# Altium project STEERING_WHEEL_SWITCHES_V2_CONTROLLER.PrjPcb
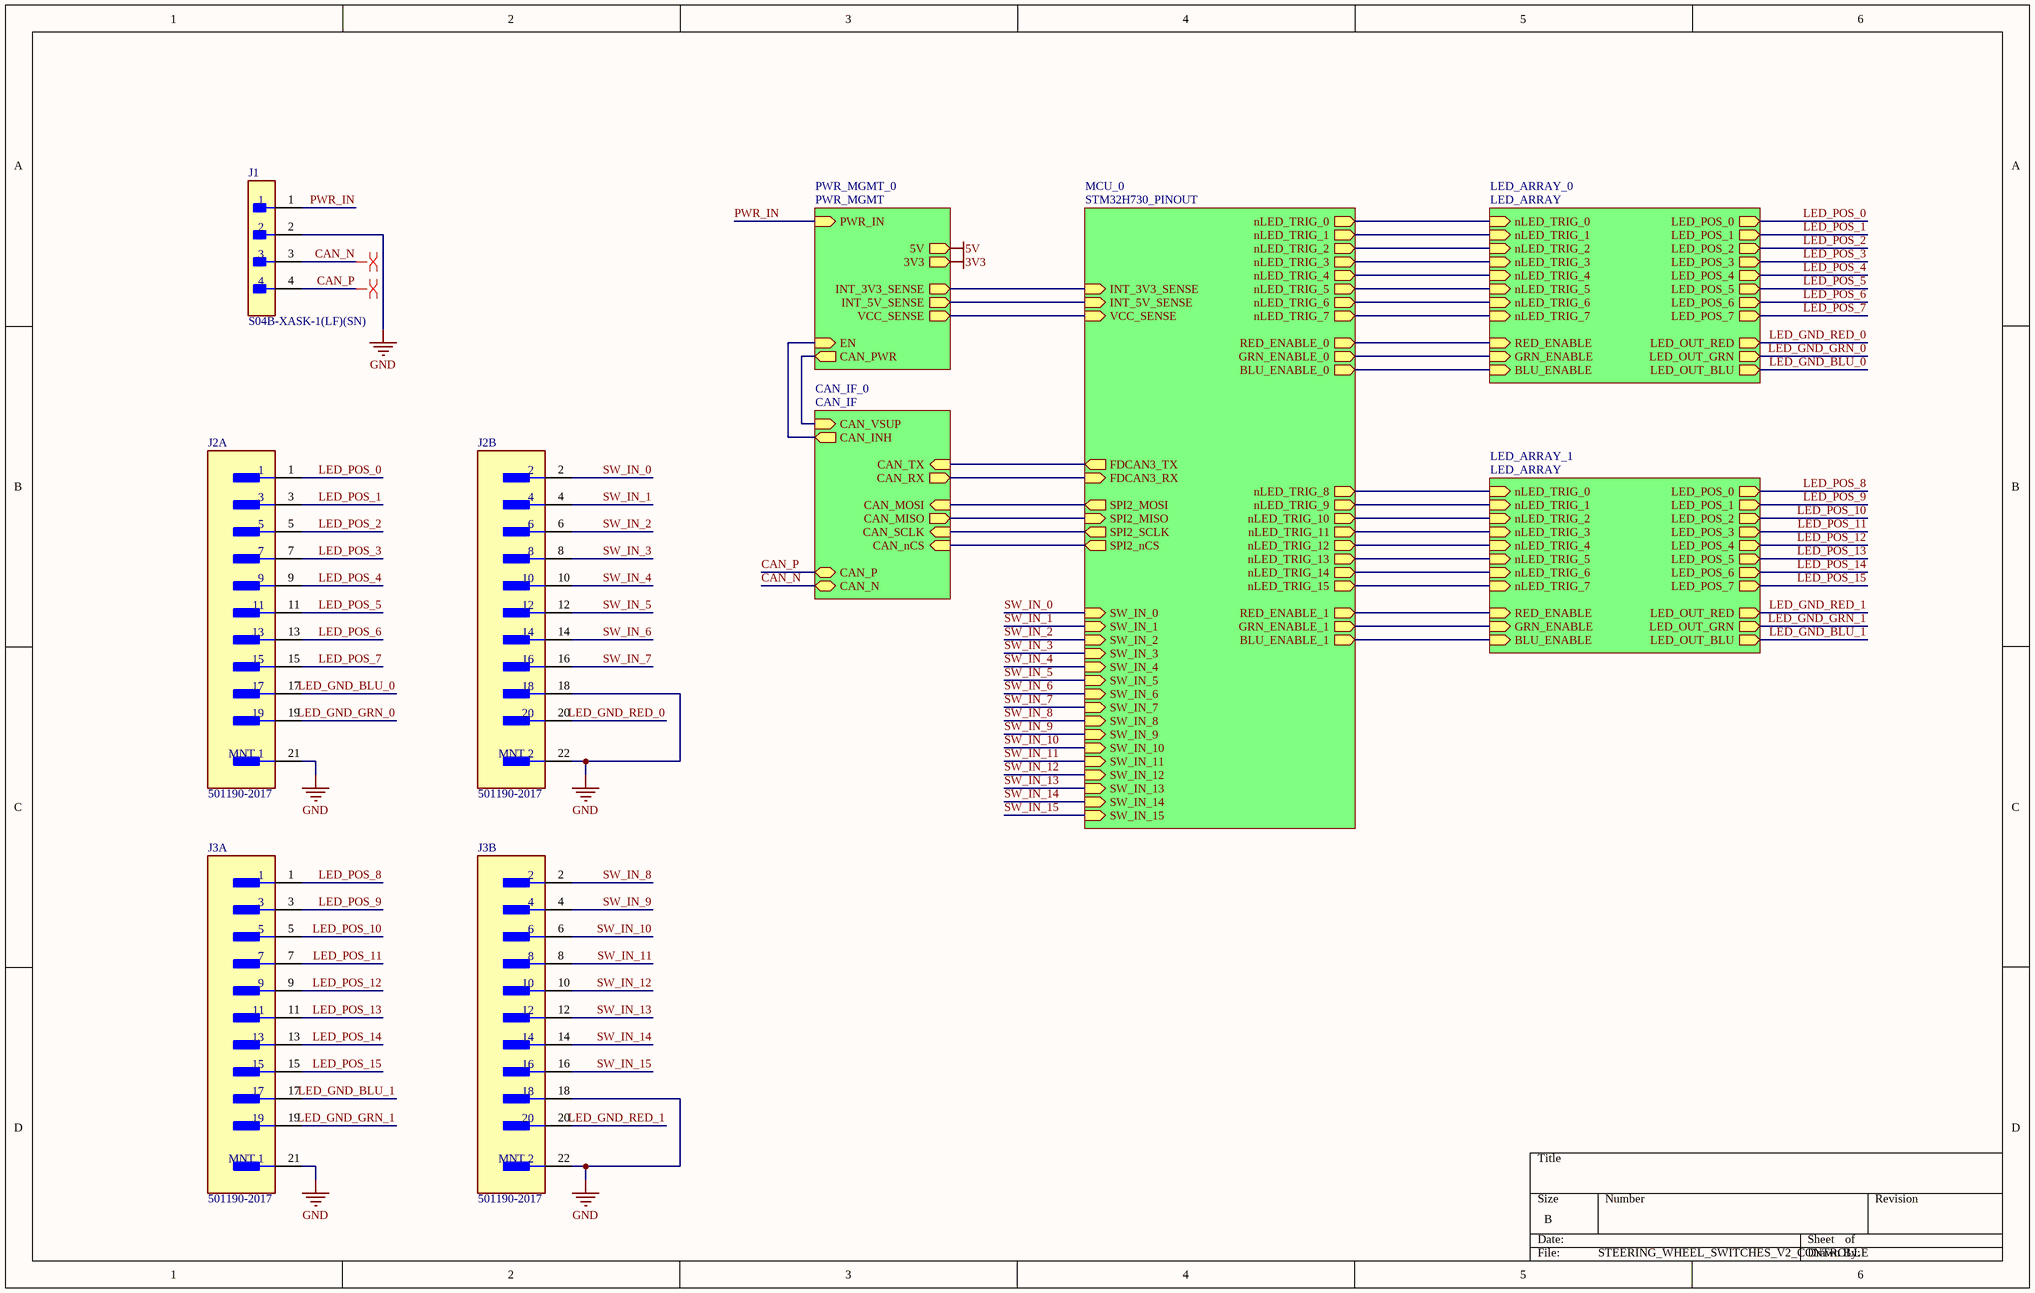
[diagram p0: STEERING_WHEEL_SWITCHES_V2_CONTROLLER.SchDoc]
4 sheets, 82 parts. Net scope: hierarchical (ports join the sheet entries above them; power ports are global).
Board file: STEERING_WHEEL_SWITCHES_V2_CONTROLLER.PcbDoc
Sheets:
  STEERING_WHEEL_SWITCHES_V2_CONTROLLER.SchDoc
    MCU_0 = STM32H730_PINOUT.SchDoc
    PWR_MGMT_0 = PWR_MGMT.SchDoc
    CAN_IF_0 = CAN_IF.SchDoc

## Sheet STEERING_WHEEL_SWITCHES_V2_CONTROLLER.SchDoc
size B; SheetNumber: 1; SheetTotal: 5

### Parts
J1  S04B-XASK-1(LF)(SN)  [FP-S04B-XASK-1_LF_SN-MFG]
J2  501190-2017  [FP-501190-2017-MFG]  (parts A,B of 2)
J3  501190-2017  [FP-501190-2017-MFG]  (parts A,B of 2)

### Sub-sheets
CAN_IF_0 = CAN_IF: CAN_VSUP (in), CAN_INH (out), CAN_MOSI (in), CAN_MISO (out), CAN_SCLK (in), CAN_nCS (in), CAN_P (bidir), CAN_N (bidir), CAN_TX (in), CAN_RX (out)
LED_ARRAY_0 = LED_ARRAY (file not in this document): nLED_TRIG_0 (in), nLED_TRIG_1 (in), nLED_TRIG_2 (in), nLED_TRIG_3 (in), nLED_TRIG_4 (in), nLED_TRIG_5 (in), nLED_TRIG_6 (in), nLED_TRIG_7 (in), RED_ENABLE (in), GRN_ENABLE (in), BLU_ENABLE (in), LED_POS_0 (out), LED_POS_1 (out), LED_POS_2 (out), LED_POS_3 (out), LED_POS_4 (out), LED_POS_5 (out), LED_POS_6 (out), LED_POS_7 (out), LED_OUT_RED (out), LED_OUT_GRN (out), LED_OUT_BLU (out)
LED_ARRAY_1 = LED_ARRAY (file not in this document): nLED_TRIG_0 (in), nLED_TRIG_1 (in), nLED_TRIG_2 (in), nLED_TRIG_3 (in), nLED_TRIG_4 (in), nLED_TRIG_5 (in), nLED_TRIG_6 (in), nLED_TRIG_7 (in), RED_ENABLE (in), GRN_ENABLE (in), BLU_ENABLE (in), LED_POS_0 (out), LED_POS_1 (out), LED_POS_2 (out), LED_POS_3 (out), LED_POS_4 (out), LED_POS_5 (out), LED_POS_6 (out), LED_POS_7 (out), LED_OUT_RED (out), LED_OUT_GRN (out), LED_OUT_BLU (out)
MCU_0 = STM32H730_PINOUT: nLED_TRIG_0 (out), nLED_TRIG_1 (out), nLED_TRIG_2 (out), nLED_TRIG_3 (out), nLED_TRIG_4 (out), nLED_TRIG_5 (out), nLED_TRIG_6 (out), nLED_TRIG_7 (out), RED_ENABLE_0 (out), GRN_ENABLE_0 (out), BLU_ENABLE_0 (out), RED_ENABLE_1 (out), GRN_ENABLE_1 (out), BLU_ENABLE_1 (out), nLED_TRIG_8 (out), nLED_TRIG_9 (out), nLED_TRIG_10 (out), nLED_TRIG_11 (out), nLED_TRIG_12 (out), nLED_TRIG_13 (out), nLED_TRIG_14 (out), nLED_TRIG_15 (out), INT_3V3_SENSE (in), INT_5V_SENSE (in), VCC_SENSE (in), SW_IN_0 (in), SW_IN_1 (in), SW_IN_2 (in), SW_IN_3 (in), SW_IN_4 (in), SW_IN_5 (in), SW_IN_6 (in), SW_IN_7 (in), SW_IN_8 (in), SW_IN_9 (in), SW_IN_10 (in), SW_IN_11 (in), SW_IN_12 (in), SW_IN_13 (in), SW_IN_14 (in), SW_IN_15 (in), FDCAN3_TX (out), FDCAN3_RX (in), SPI2_MOSI (out), SPI2_MISO (in), SPI2_SCLK (out), SPI2_nCS (out)
PWR_MGMT_0 = PWR_MGMT: PWR_IN (in), 5V (out), 3V3 (out), INT_3V3_SENSE (out), INT_5V_SENSE (out), VCC_SENSE (out), CAN_PWR (out), EN (in)

### Nets
GND: J1.2 J2.18 J2.21(MNT_1) J2.22(MNT_2) J3.18 J3.21(MNT_1) J3.22(MNT_2)
BLU_ENABLE_0: sheet MCU_0/BLU_ENABLE_0, sheet LED_ARRAY_0/BLU_ENABLE
BLU_ENABLE_1: sheet MCU_0/BLU_ENABLE_1, sheet LED_ARRAY_1/BLU_ENABLE
CAN_INH: sheet PWR_MGMT_0/EN, sheet CAN_IF_0/CAN_INH
CAN_MISO: sheet MCU_0/SPI2_MISO, sheet CAN_IF_0/CAN_MISO
CAN_MOSI: sheet MCU_0/SPI2_MOSI, sheet CAN_IF_0/CAN_MOSI
CAN_N: J1.3 ; sheet CAN_IF_0/CAN_N
CAN_nCS: sheet MCU_0/SPI2_nCS, sheet CAN_IF_0/CAN_nCS
CAN_P: J1.4 ; sheet CAN_IF_0/CAN_P
CAN_PWR: sheet PWR_MGMT_0/CAN_PWR, sheet CAN_IF_0/CAN_VSUP
CAN_RX: sheet MCU_0/FDCAN3_RX, sheet CAN_IF_0/CAN_RX
CAN_SCLK: sheet MCU_0/SPI2_SCLK, sheet CAN_IF_0/CAN_SCLK
CAN_TX: sheet MCU_0/FDCAN3_TX, sheet CAN_IF_0/CAN_TX
GRN_ENABLE_0: sheet MCU_0/GRN_ENABLE_0, sheet LED_ARRAY_0/GRN_ENABLE
GRN_ENABLE_1: sheet MCU_0/GRN_ENABLE_1, sheet LED_ARRAY_1/GRN_ENABLE
INT_3V3_SENSE: sheet MCU_0/INT_3V3_SENSE, sheet PWR_MGMT_0/INT_3V3_SENSE
INT_5V_SENSE: sheet MCU_0/INT_5V_SENSE, sheet PWR_MGMT_0/INT_5V_SENSE
LED_GND_BLU_0: J2.17 ; sheet LED_ARRAY_0/LED_OUT_BLU
LED_GND_BLU_1: J3.17 ; sheet LED_ARRAY_1/LED_OUT_BLU
LED_GND_GRN_0: J2.19 ; sheet LED_ARRAY_0/LED_OUT_GRN
LED_GND_GRN_1: J3.19 ; sheet LED_ARRAY_1/LED_OUT_GRN
LED_GND_RED_0: J2.20 ; sheet LED_ARRAY_0/LED_OUT_RED
LED_GND_RED_1: J3.20 ; sheet LED_ARRAY_1/LED_OUT_RED
LED_POS_0: J2.1 ; sheet LED_ARRAY_0/LED_POS_0
LED_POS_1: J2.3 ; sheet LED_ARRAY_0/LED_POS_1
LED_POS_2: J2.5 ; sheet LED_ARRAY_0/LED_POS_2
LED_POS_3: J2.7 ; sheet LED_ARRAY_0/LED_POS_3
LED_POS_4: J2.9 ; sheet LED_ARRAY_0/LED_POS_4
LED_POS_5: J2.11 ; sheet LED_ARRAY_0/LED_POS_5
LED_POS_6: J2.13 ; sheet LED_ARRAY_0/LED_POS_6
LED_POS_7: J2.15 ; sheet LED_ARRAY_0/LED_POS_7
LED_POS_8: J3.1 ; sheet LED_ARRAY_1/LED_POS_0
LED_POS_9: J3.3 ; sheet LED_ARRAY_1/LED_POS_1
LED_POS_10: J3.5 ; sheet LED_ARRAY_1/LED_POS_2
LED_POS_11: J3.7 ; sheet LED_ARRAY_1/LED_POS_3
LED_POS_12: J3.9 ; sheet LED_ARRAY_1/LED_POS_4
LED_POS_13: J3.11 ; sheet LED_ARRAY_1/LED_POS_5
LED_POS_14: J3.13 ; sheet LED_ARRAY_1/LED_POS_6
LED_POS_15: J3.15 ; sheet LED_ARRAY_1/LED_POS_7
nLED_TRIG_0: sheet MCU_0/nLED_TRIG_0, sheet LED_ARRAY_0/nLED_TRIG_0
nLED_TRIG_1: sheet MCU_0/nLED_TRIG_1, sheet LED_ARRAY_0/nLED_TRIG_1
nLED_TRIG_2: sheet MCU_0/nLED_TRIG_2, sheet LED_ARRAY_0/nLED_TRIG_2
nLED_TRIG_3: sheet MCU_0/nLED_TRIG_3, sheet LED_ARRAY_0/nLED_TRIG_3
nLED_TRIG_4: sheet MCU_0/nLED_TRIG_4, sheet LED_ARRAY_0/nLED_TRIG_4
nLED_TRIG_5: sheet MCU_0/nLED_TRIG_5, sheet LED_ARRAY_0/nLED_TRIG_5
nLED_TRIG_6: sheet MCU_0/nLED_TRIG_6, sheet LED_ARRAY_0/nLED_TRIG_6
nLED_TRIG_7: sheet MCU_0/nLED_TRIG_7, sheet LED_ARRAY_0/nLED_TRIG_7
nLED_TRIG_8: sheet MCU_0/nLED_TRIG_8, sheet LED_ARRAY_1/nLED_TRIG_0
nLED_TRIG_9: sheet MCU_0/nLED_TRIG_9, sheet LED_ARRAY_1/nLED_TRIG_1
nLED_TRIG_10: sheet MCU_0/nLED_TRIG_10, sheet LED_ARRAY_1/nLED_TRIG_2
nLED_TRIG_11: sheet MCU_0/nLED_TRIG_11, sheet LED_ARRAY_1/nLED_TRIG_3
nLED_TRIG_12: sheet MCU_0/nLED_TRIG_12, sheet LED_ARRAY_1/nLED_TRIG_4
nLED_TRIG_13: sheet MCU_0/nLED_TRIG_13, sheet LED_ARRAY_1/nLED_TRIG_5
nLED_TRIG_14: sheet MCU_0/nLED_TRIG_14, sheet LED_ARRAY_1/nLED_TRIG_6
nLED_TRIG_15: sheet MCU_0/nLED_TRIG_15, sheet LED_ARRAY_1/nLED_TRIG_7
PWR_IN: J1.1 ; sheet PWR_MGMT_0/PWR_IN
RED_ENABLE_0: sheet MCU_0/RED_ENABLE_0, sheet LED_ARRAY_0/RED_ENABLE
RED_ENABLE_1: sheet MCU_0/RED_ENABLE_1, sheet LED_ARRAY_1/RED_ENABLE
SW_IN_0: J2.2 ; sheet MCU_0/SW_IN_0
SW_IN_1: J2.4 ; sheet MCU_0/SW_IN_1
SW_IN_2: J2.6 ; sheet MCU_0/SW_IN_2
SW_IN_3: J2.8 ; sheet MCU_0/SW_IN_3
SW_IN_4: J2.10 ; sheet MCU_0/SW_IN_4
SW_IN_5: J2.12 ; sheet MCU_0/SW_IN_5
SW_IN_6: J2.14 ; sheet MCU_0/SW_IN_6
SW_IN_7: J2.16 ; sheet MCU_0/SW_IN_7
SW_IN_8: J3.2 ; sheet MCU_0/SW_IN_8
SW_IN_9: J3.4 ; sheet MCU_0/SW_IN_9
SW_IN_10: J3.6 ; sheet MCU_0/SW_IN_10
SW_IN_11: J3.8 ; sheet MCU_0/SW_IN_11
SW_IN_12: J3.10 ; sheet MCU_0/SW_IN_12
SW_IN_13: J3.12 ; sheet MCU_0/SW_IN_13
SW_IN_14: J3.14 ; sheet MCU_0/SW_IN_14
SW_IN_15: J3.16 ; sheet MCU_0/SW_IN_15
VCC_SENSE: sheet MCU_0/VCC_SENSE, sheet PWR_MGMT_0/VCC_SENSE

### Layout directives
differential pair: CAN_N, CAN_P

### Library data of the parts
J1 = CMP-17439-000091-1: CONN HEADER R/A 4POS 2.5MM; Number of Contacts: 4; Voltage Rating (AC): 250V; Current Rating: 3A; Insulation Resistance: 1GR; Gender: Male; Wire/Cable Gauge: 20AWG; Contact Resistance: 10mR; Lead Length: 3.4mm; Insulation Material: Nylon; Fastening Type: Ramp; Height: 7.6mm; Packaging: Bulk; Voltage Rating: 250V; Contact Type: Male Pin; REACH SVHC: No SVHC; Series: XA; Connector Type: Header; Number of Positions: 4; Contact Shape: Circular; Insulation Color: Natural; Contact Finish - Mating: TIN; Number of Pins: 4; Color: Beige; Orientation: Right Angle; Length: 12.5mm; Lead Free: Lead Free; Contact Material: Copper Alloy; Min Operating Temperature: -25°C; Contact Plating: Tin; Number of Poles: 4; Number of Rows: 1; Width: 12.6mm; Voltage Rating (DC): 250V; Mount: Through Hole; Flammability Rating: UL94 V-0; Max Operating Temperature: 85°C; Termination: Solder; Material: Nylon; Pitch: 2.5mm
J2 J3 = CMP-04776-000294-1: CONN HEADER SMD 20POS 1MM; Contact Resistance: 20mR; Number of Contacts: 20; Voltage Rating: 50V; Connector Type: Male Pin; Current Rating: 1A; Glow Wire Compliant: Non-compliant; Row Spacing: 0.105inch; Gender: Male; Termination: Solder; Housing Color: Natural; Package Quantity: 1100; Contact Type: Male Pin; Number of Circuits: 20; Min Operating Temperature: -40°C; Mount: Surface Mount; Length: 12.3mm; Pitch: 1mm; Housing Material: Thermoplastic; Depth: 7.27mm; Orientation: Vertical; Max Operating Temperature: 85°C; Lead Free: Lead Free; Voltage Rating (DC): 50V; Series: Pico-Clasp; Number of Rows: 2; Contact Material: Bronze; Contact Plating: Gold; Color: Natural; Radiation Hardening: No; Fastening Type: Latch; Packaging: Tape and Reel; Number of Positions: 20

## Sheet STM32H730_PINOUT.SchDoc
size D; SheetNumber: 2; SheetTotal: 5
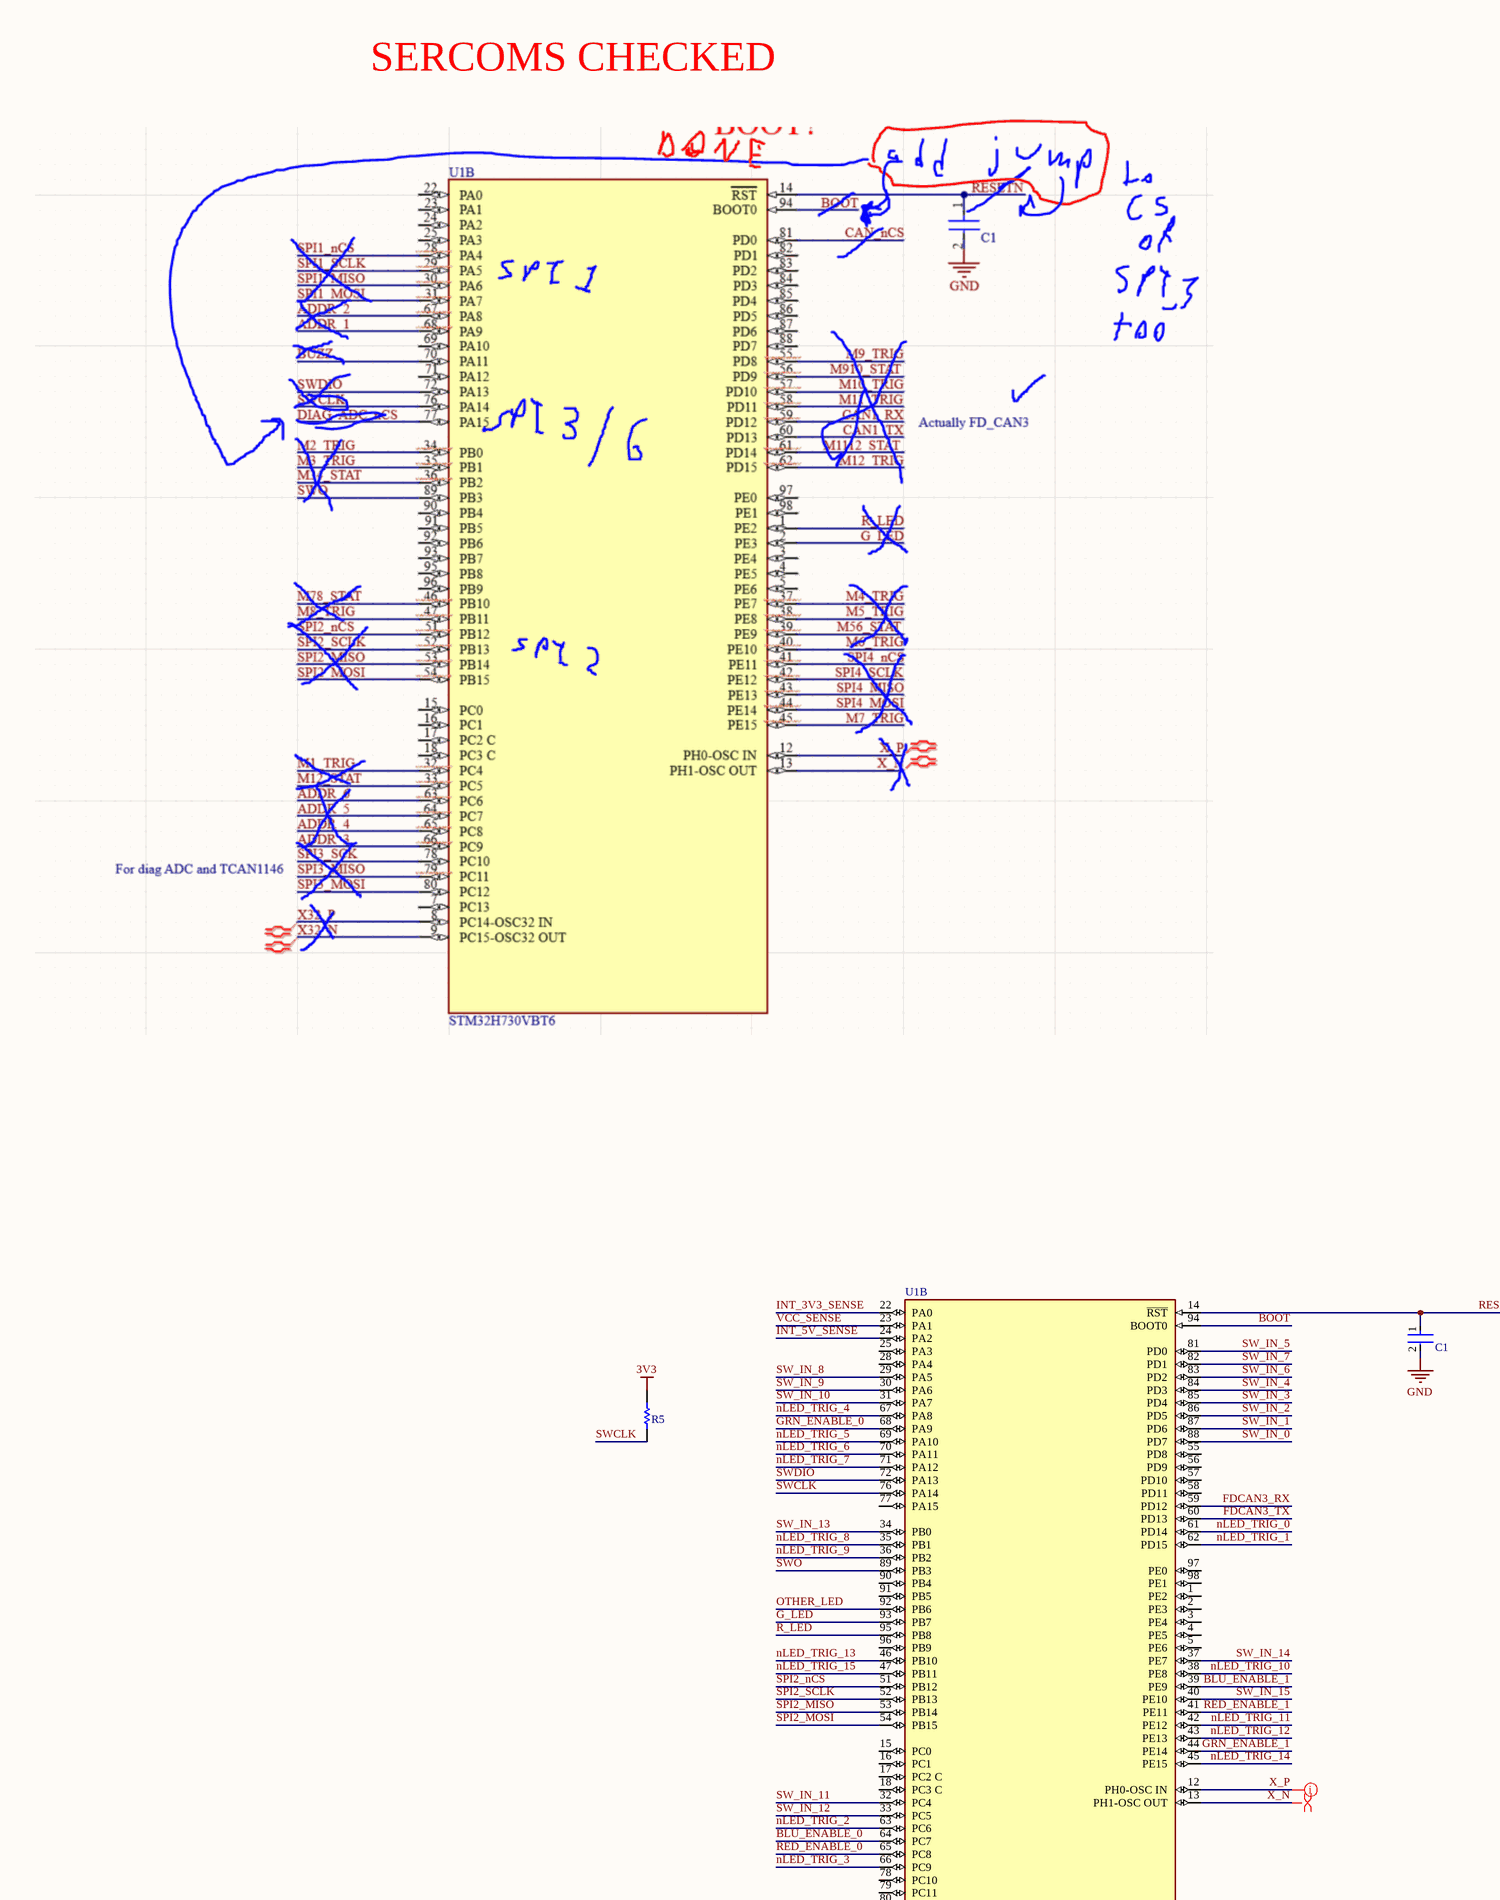
[diagram p1: STM32H730_PINOUT.SchDoc, top left]
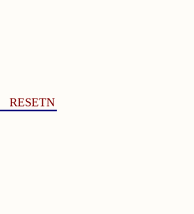
[diagram p2: STM32H730_PINOUT.SchDoc, top middle]
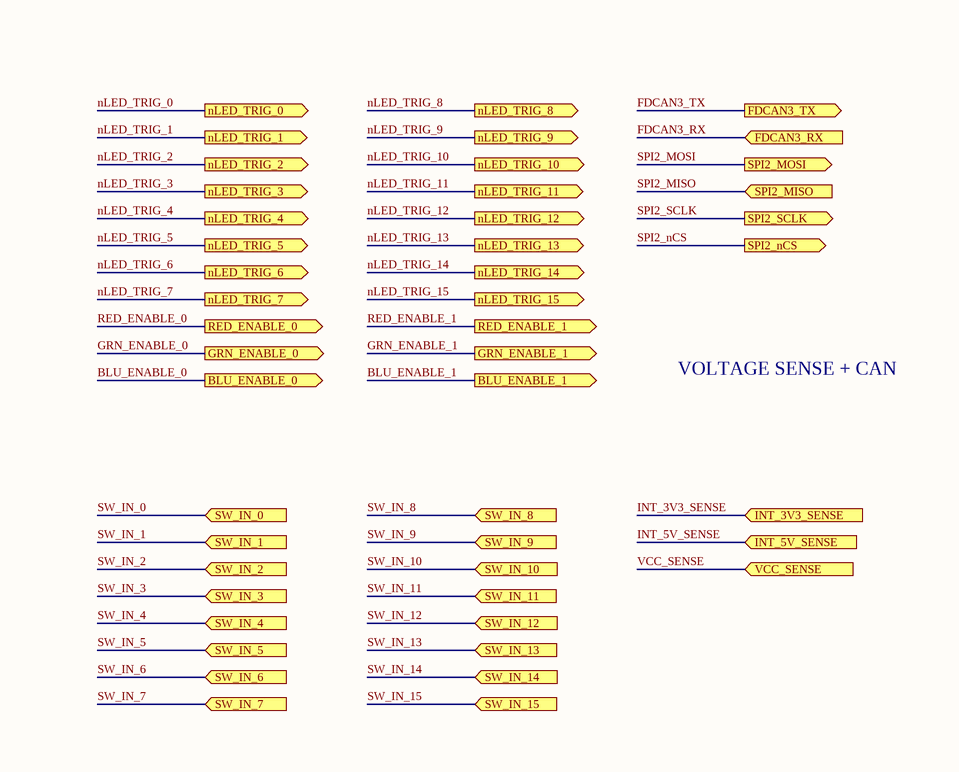
[diagram p3: STM32H730_PINOUT.SchDoc, top right]
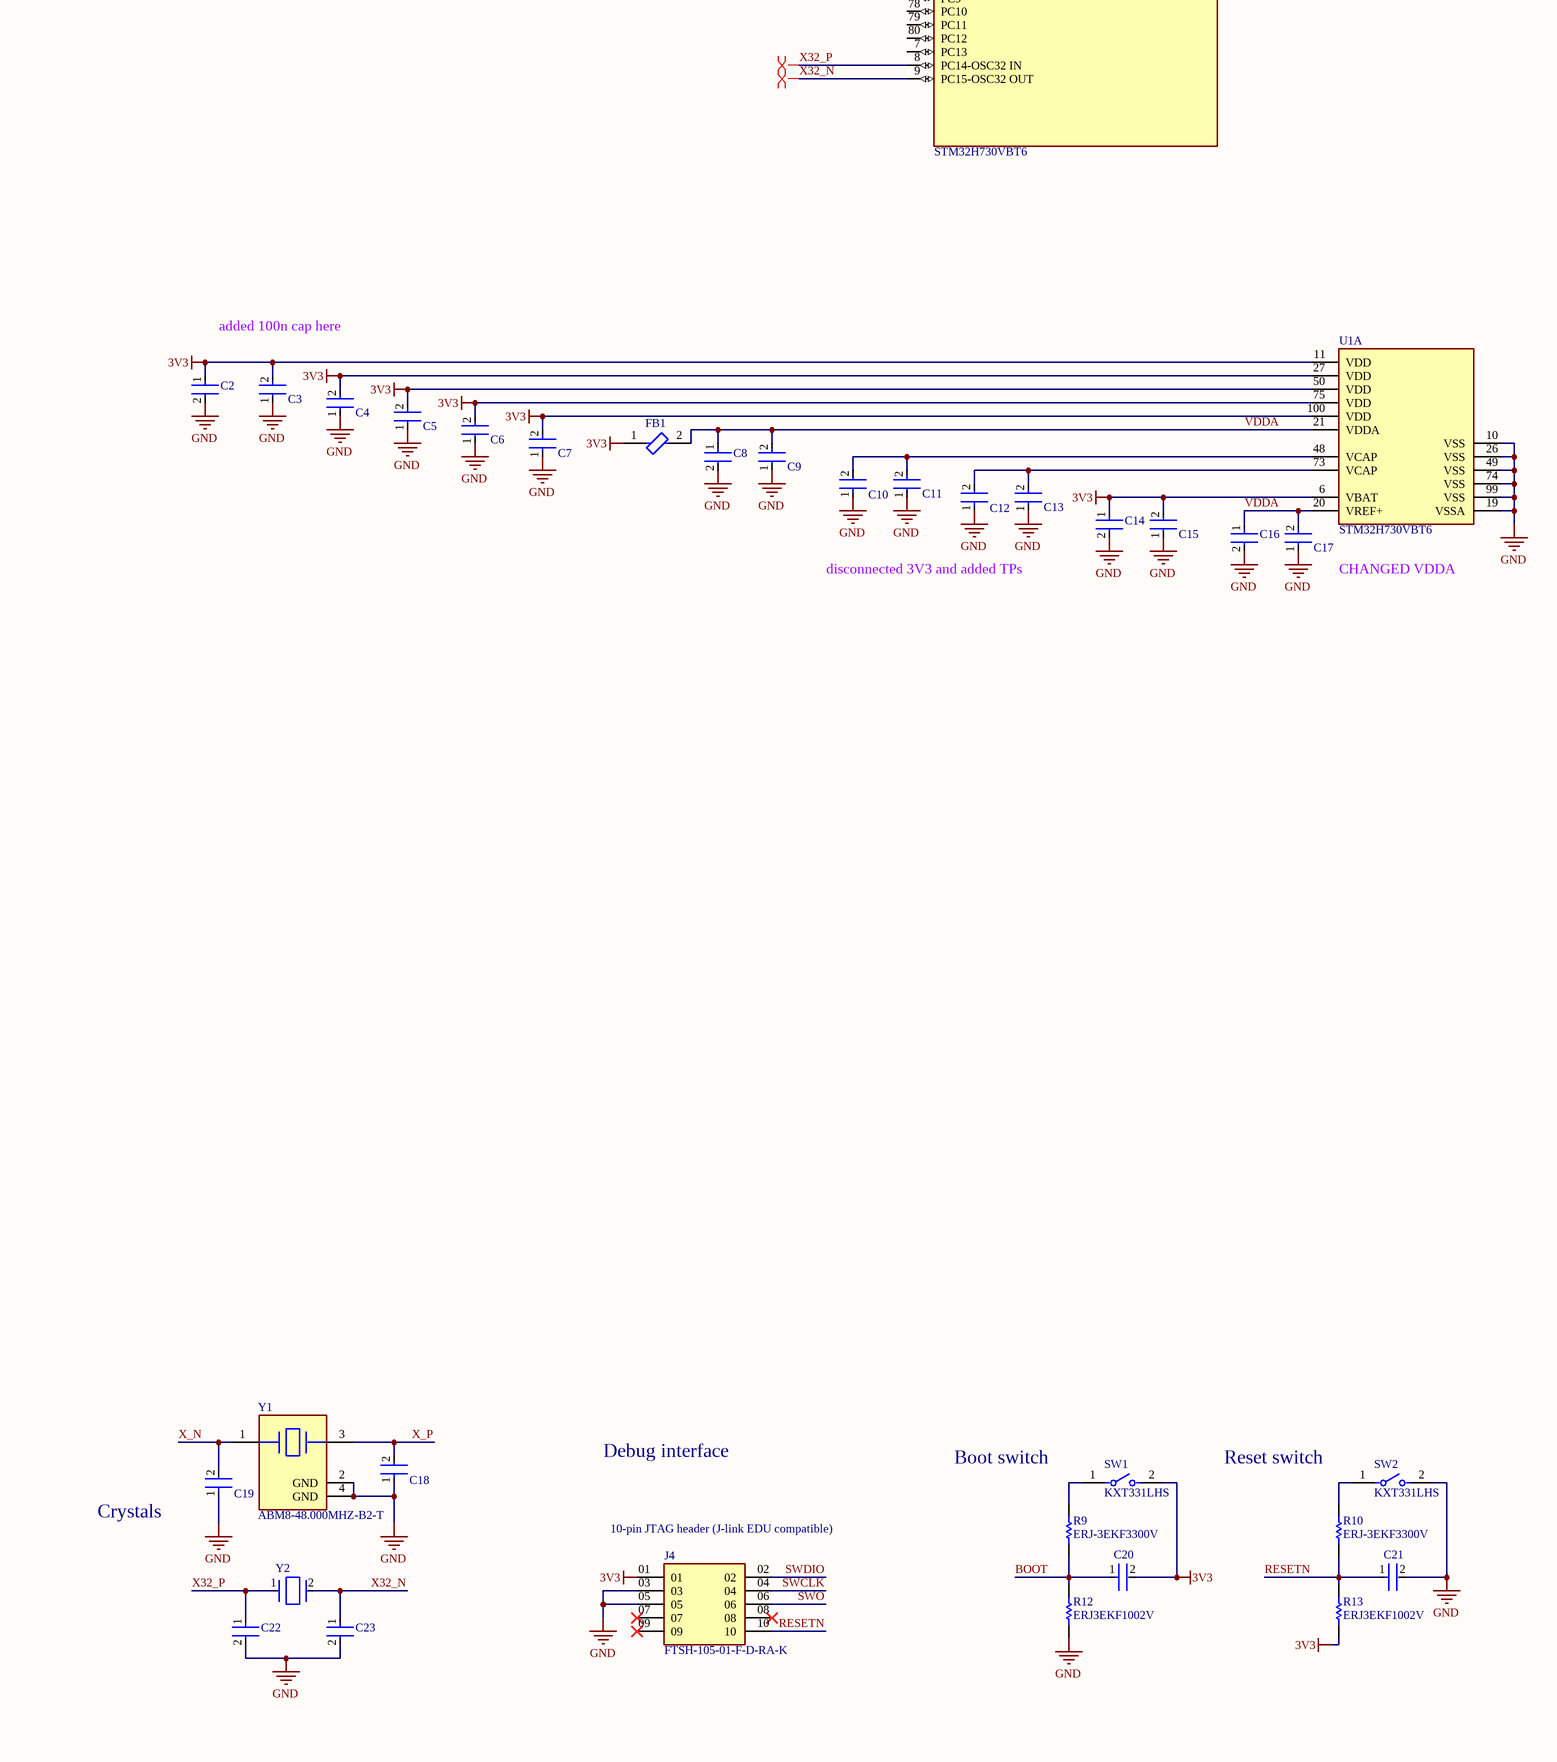
[diagram p4: STM32H730_PINOUT.SchDoc, bottom left]
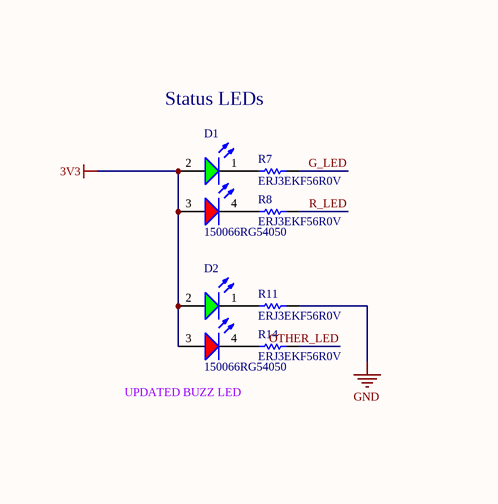
[diagram p5: STM32H730_PINOUT.SchDoc, bottom middle]
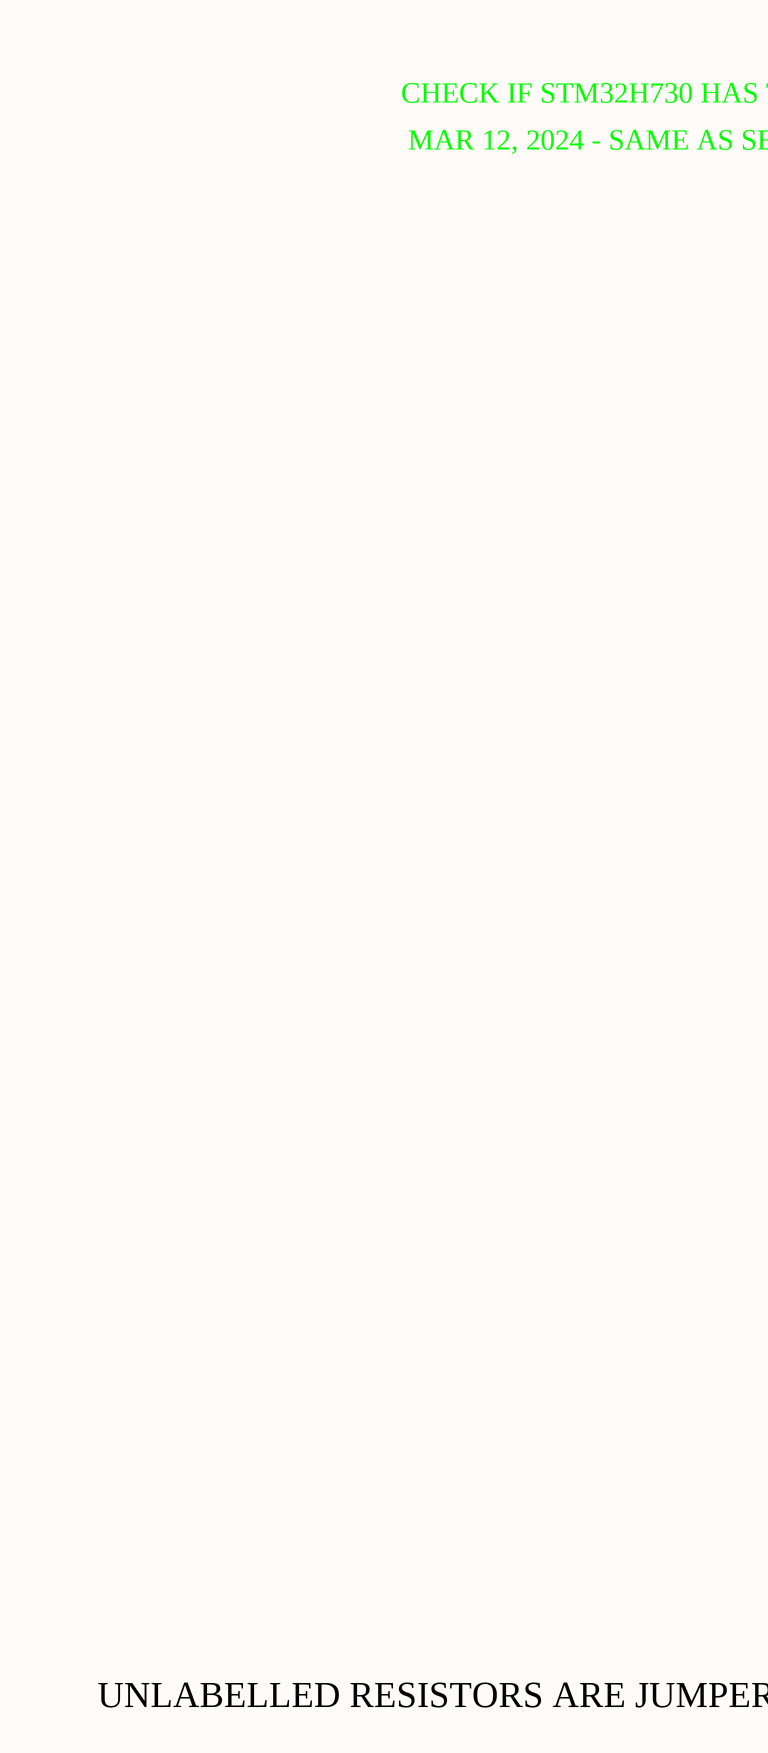
[diagram p6: STM32H730_PINOUT.SchDoc, bottom right]

### Parts
C1  C0402C104K8PACTU  [FP-C0402-BB-MFG]  (value not drawn)
C2  C1005X5R1A475K050BC  [FP-C1005-050-0_15-MFG]  (value not drawn)
C3  GRM155R71C104KA88D  [FP-GRM15-MFG]  (value not drawn)
C4  GRM155R71C104KA88D  [FP-GRM15-MFG]  (value not drawn)
C5  GRM155R71C104KA88D  [FP-GRM15-MFG]  (value not drawn)
C6  GRM155R71C104KA88D  [FP-GRM15-MFG]  (value not drawn)
C7  GRM155R71C104KA88D  [FP-GRM15-MFG]  (value not drawn)
C8  EMK105BJ105KV-F  [FP-0402-L_1_0_0_05-W_0_5-IPC_A]  (value not drawn)
C9  GRM155R71C104KA88D  [FP-GRM15-MFG]  (value not drawn)
C10  C1005X7S1A225K050BC  [FP-C1005-050-0_15-0_1-MFG]  (value not drawn)
C11  GRM155R71C104KA88D  [FP-GRM15-MFG]  (value not drawn)
C12  C1005X7S1A225K050BC  [FP-C1005-050-0_15-0_1-MFG]  (value not drawn)
C13  GRM155R71C104KA88D  [FP-GRM15-MFG]  (value not drawn)
C14  EMK105BJ105KV-F  [FP-0402-L_1_0_0_05-W_0_5-IPC_A]  (value not drawn)
C15  GRM155R71C104KA88D  [FP-GRM15-MFG]  (value not drawn)
C16  EMK105BJ105KV-F  [FP-0402-L_1_0_0_05-W_0_5-IPC_A]  (value not drawn)
C17  GRM155R71C104KA88D  [FP-GRM15-MFG]  (value not drawn)
C18  08051A6R8CAT2A  [FP-0805-L_2_01_0_2-W_1_25-MFG]  (value not drawn)
C19  08051A6R8CAT2A  [FP-0805-L_2_01_0_2-W_1_25-MFG]  (value not drawn)
C20  C0402C104K8PACTU  [FP-C0402-BB-MFG]  (value not drawn)
C21  C0402C104K8PACTU  [FP-C0402-BB-MFG]  (value not drawn)
C22  04025A180FAT2A  [FP-0402-L_1_0_1-W_0_5_0_1-IPC_A]  (value not drawn)
C23  04025A180FAT2A  [FP-0402-L_1_0_1-W_0_5_0_1-IPC_A]  (value not drawn)
D1  150066RG54050  [WL-SBCD_0606]
D2  150066RG54050  [WL-SBCD_0606]
FB1  BLM15PX601SN1D  [FP-BLM15-0_05-MFG]  (value not drawn)
J4  FTSH-105-01-F-D-RA-K  [FTSH-105-01-F-D-RA-K-Footprint-1]
R5  ERJ3EKF1002V  [RESC1609X55X30LL15T15]  (value not drawn)
R7  ERJ3EKF56R0V  [RESC1608X55X30NL15T15]
R8  ERJ3EKF56R0V  [RESC1608X55X30NL15T15]
R9  ERJ-3EKF3300V  [RESC1608X55X30LL15T15]
R10  ERJ-3EKF3300V  [RESC1608X55X30LL15T15]
R11  ERJ3EKF56R0V  [RESC1608X55X30NL15T15]
R12  ERJ3EKF1002V  [RESC1609X55X30LL15T15]
R13  ERJ3EKF1002V  [RESC1609X55X30LL15T15]
R14  ERJ3EKF56R0V  [RESC1608X55X30NL15T15]
SW1  KXT331LHS  [FP-KXT331LHS-MFG]
SW2  KXT331LHS  [FP-KXT331LHS-MFG]
U1  STM32H730VBT6  [FP-LQFP100-1L-IPC_C]  (parts A,B of 2)
Y1  ABM8-48.000MHZ-B2-T  [FP-ABM8-MFG]
Y2  ECS-.327-12.5-1210-TR  [FP-ECX-1210-MFG]  (value not drawn)

### Ports
BLU_ENABLE_0 (out, see STEERING_WHEEL_SWITCHES_V2_CONTROLLER[5B]), BLU_ENABLE_1 (out, see STEERING_WHEEL_SWITCHES_V2_CONTROLLER[5B]), FDCAN3_RX (in, see STEERING_WHEEL_SWITCHES_V2_CONTROLLER[4B]), FDCAN3_TX (out, see STEERING_WHEEL_SWITCHES_V2_CONTROLLER[4B]), GRN_ENABLE_0 (out, see STEERING_WHEEL_SWITCHES_V2_CONTROLLER[5B]), GRN_ENABLE_1 (out, see STEERING_WHEEL_SWITCHES_V2_CONTROLLER[5B]), INT_3V3_SENSE (in, see STEERING_WHEEL_SWITCHES_V2_CONTROLLER[4A], PWR_MGMT[4B]), INT_5V_SENSE (in, see STEERING_WHEEL_SWITCHES_V2_CONTROLLER[4A], PWR_MGMT[4C]), nLED_TRIG_0 (out, see STEERING_WHEEL_SWITCHES_V2_CONTROLLER[5A], LED_ARRAY[1A]), nLED_TRIG_1 (out, see STEERING_WHEEL_SWITCHES_V2_CONTROLLER[5A], LED_ARRAY[1A]), nLED_TRIG_2 (out, see STEERING_WHEEL_SWITCHES_V2_CONTROLLER[5A], LED_ARRAY[1A]), nLED_TRIG_3 (out, see STEERING_WHEEL_SWITCHES_V2_CONTROLLER[5A], LED_ARRAY[1A]), nLED_TRIG_4 (out, see STEERING_WHEEL_SWITCHES_V2_CONTROLLER[5A], LED_ARRAY[1A]), nLED_TRIG_5 (out, see STEERING_WHEEL_SWITCHES_V2_CONTROLLER[5A], LED_ARRAY[1A]), nLED_TRIG_6 (out, see STEERING_WHEEL_SWITCHES_V2_CONTROLLER[5A], LED_ARRAY[1A]), nLED_TRIG_7 (out, see STEERING_WHEEL_SWITCHES_V2_CONTROLLER[5A], LED_ARRAY[1A]), nLED_TRIG_8 (out, see STEERING_WHEEL_SWITCHES_V2_CONTROLLER[5B]), nLED_TRIG_9 (out, see STEERING_WHEEL_SWITCHES_V2_CONTROLLER[5B]), nLED_TRIG_10 (out, see STEERING_WHEEL_SWITCHES_V2_CONTROLLER[5B]), nLED_TRIG_11 (out, see STEERING_WHEEL_SWITCHES_V2_CONTROLLER[5B]), nLED_TRIG_12 (out, see STEERING_WHEEL_SWITCHES_V2_CONTROLLER[5B]), nLED_TRIG_13 (out, see STEERING_WHEEL_SWITCHES_V2_CONTROLLER[5B]), nLED_TRIG_14 (out, see STEERING_WHEEL_SWITCHES_V2_CONTROLLER[5B]), nLED_TRIG_15 (out, see STEERING_WHEEL_SWITCHES_V2_CONTROLLER[5B]), RED_ENABLE_0 (out, see STEERING_WHEEL_SWITCHES_V2_CONTROLLER[5B]), RED_ENABLE_1 (out, see STEERING_WHEEL_SWITCHES_V2_CONTROLLER[5B]), SPI2_MISO (in, see STEERING_WHEEL_SWITCHES_V2_CONTROLLER[4B]), SPI2_MOSI (out, see STEERING_WHEEL_SWITCHES_V2_CONTROLLER[4B]), SPI2_nCS (out, see STEERING_WHEEL_SWITCHES_V2_CONTROLLER[4B]), SPI2_SCLK (out, see STEERING_WHEEL_SWITCHES_V2_CONTROLLER[4B]), SW_IN_0 (in, see STEERING_WHEEL_SWITCHES_V2_CONTROLLER[4B]), SW_IN_1 (in, see STEERING_WHEEL_SWITCHES_V2_CONTROLLER[4B]), SW_IN_2 (in, see STEERING_WHEEL_SWITCHES_V2_CONTROLLER[4B]), SW_IN_3 (in, see STEERING_WHEEL_SWITCHES_V2_CONTROLLER[4C]), SW_IN_4 (in, see STEERING_WHEEL_SWITCHES_V2_CONTROLLER[4C]), SW_IN_5 (in, see STEERING_WHEEL_SWITCHES_V2_CONTROLLER[4C]), SW_IN_6 (in, see STEERING_WHEEL_SWITCHES_V2_CONTROLLER[4C]), SW_IN_7 (in, see STEERING_WHEEL_SWITCHES_V2_CONTROLLER[4C]), SW_IN_8 (in, see STEERING_WHEEL_SWITCHES_V2_CONTROLLER[4C]), SW_IN_9 (in, see STEERING_WHEEL_SWITCHES_V2_CONTROLLER[4C]), SW_IN_10 (in, see STEERING_WHEEL_SWITCHES_V2_CONTROLLER[4C]), SW_IN_11 (in, see STEERING_WHEEL_SWITCHES_V2_CONTROLLER[4C]), SW_IN_12 (in, see STEERING_WHEEL_SWITCHES_V2_CONTROLLER[4C]), SW_IN_13 (in, see STEERING_WHEEL_SWITCHES_V2_CONTROLLER[4C]), SW_IN_14 (in, see STEERING_WHEEL_SWITCHES_V2_CONTROLLER[4C]), SW_IN_15 (in, see STEERING_WHEEL_SWITCHES_V2_CONTROLLER[4C]), VCC_SENSE (in, see STEERING_WHEEL_SWITCHES_V2_CONTROLLER[4A], PWR_MGMT[3C])

### Nets
3V3: C2.1 C3.2 C4.2 C5.2 C6.2 C7.2 C14.1 C15.2 C20.2 D1.2(A) D1.3(A) D2.2(A) D2.3(A) FB1.1 J4.01 R5.1 R13.1 SW1.2 U1.6(VBAT) U1.11(VDD) U1.27(VDD) U1.50(VDD) U1.75(VDD) U1.100(VDD)
GND: C1.2 C2.2 C3.1 C4.1 C5.1 C6.1 C7.1 C8.2 C9.1 C10.1 C11.1 C12.1 C13.1 C14.2 C15.1 C16.2 C17.1 C18.1 C19.1 C21.2 C22.2 C23.2 J4.03 J4.05 R11.1 R12.1 SW2.2 U1.10(VSS) U1.19(VSSA) U1.26(VSS) U1.49(VSS) U1.74(VSS) U1.99(VSS) Y1.2(GND) Y1.4(GND)
BLU_ENABLE_0: U1.64(PC7) ; port BLU_ENABLE_0
BLU_ENABLE_1: U1.39(PE9) ; port BLU_ENABLE_1
BOOT: C20.1 R9.1 R12.2 U1.94(BOOT0)
FDCAN3_RX: U1.59(PD12) ; port FDCAN3_RX  [project net CAN_RX]
FDCAN3_TX: U1.60(PD13) ; port FDCAN3_TX  [project net CAN_TX]
G_LED: R7.1 U1.93(PB7)
GRN_ENABLE_0: U1.68(PA9) ; port GRN_ENABLE_0
GRN_ENABLE_1: U1.44(PE14) ; port GRN_ENABLE_1
INT_3V3_SENSE: U1.22(PA0) ; port INT_3V3_SENSE
INT_5V_SENSE: U1.24(PA2) ; port INT_5V_SENSE
nLED_TRIG_0: U1.61(PD14) ; port nLED_TRIG_0
nLED_TRIG_1: U1.62(PD15) ; port nLED_TRIG_1
nLED_TRIG_2: U1.63(PC6) ; port nLED_TRIG_2
nLED_TRIG_3: U1.66(PC9) ; port nLED_TRIG_3
nLED_TRIG_4: U1.67(PA8) ; port nLED_TRIG_4
nLED_TRIG_5: U1.69(PA10) ; port nLED_TRIG_5
nLED_TRIG_6: U1.70(PA11) ; port nLED_TRIG_6
nLED_TRIG_7: U1.71(PA12) ; port nLED_TRIG_7
nLED_TRIG_8: U1.35(PB1) ; port nLED_TRIG_8
nLED_TRIG_9: U1.36(PB2) ; port nLED_TRIG_9
nLED_TRIG_10: U1.38(PE8) ; port nLED_TRIG_10
nLED_TRIG_11: U1.42(PE12) ; port nLED_TRIG_11
nLED_TRIG_12: U1.43(PE13) ; port nLED_TRIG_12
nLED_TRIG_13: U1.46(PB10) ; port nLED_TRIG_13
nLED_TRIG_14: U1.45(PE15) ; port nLED_TRIG_14
nLED_TRIG_15: U1.47(PB11) ; port nLED_TRIG_15
OTHER_LED: R14.1 U1.92(PB6)
R_LED: R8.1 U1.95(PB8)
RED_ENABLE_0: U1.65(PC8) ; port RED_ENABLE_0
RED_ENABLE_1: U1.41(PE11) ; port RED_ENABLE_1
RESETN: C1.1 C21.1 J4.10 R10.1 R13.2 U1.14(~{RST})
SPI2_MISO: U1.53(PB14) ; port SPI2_MISO  [project net CAN_MISO]
SPI2_MOSI: U1.54(PB15) ; port SPI2_MOSI  [project net CAN_MOSI]
SPI2_nCS: U1.51(PB12) ; port SPI2_nCS  [project net CAN_nCS]
SPI2_SCLK: U1.52(PB13) ; port SPI2_SCLK  [project net CAN_SCLK]
SW_IN_0: U1.88(PD7) ; port SW_IN_0
SW_IN_1: U1.87(PD6) ; port SW_IN_1
SW_IN_2: U1.86(PD5) ; port SW_IN_2
SW_IN_3: U1.85(PD4) ; port SW_IN_3
SW_IN_4: U1.84(PD3) ; port SW_IN_4
SW_IN_5: U1.81(PD0) ; port SW_IN_5
SW_IN_6: U1.83(PD2) ; port SW_IN_6
SW_IN_7: U1.82(PD1) ; port SW_IN_7
SW_IN_8: U1.29(PA5) ; port SW_IN_8
SW_IN_9: U1.30(PA6) ; port SW_IN_9
SW_IN_10: U1.31(PA7) ; port SW_IN_10
SW_IN_11: U1.32(PC4) ; port SW_IN_11
SW_IN_12: U1.33(PC5) ; port SW_IN_12
SW_IN_13: U1.34(PB0) ; port SW_IN_13
SW_IN_14: U1.37(PE7) ; port SW_IN_14
SW_IN_15: U1.40(PE10) ; port SW_IN_15
SWCLK: J4.04 R5.2 U1.76(PA14)
SWDIO: J4.02 U1.72(PA13)
SWO: J4.06 U1.89(PB3)
VCC_SENSE: U1.23(PA1) ; port VCC_SENSE
VDDA: C8.1 C9.2 C16.1 C17.2 FB1.2 U1.20(VREF+) U1.21(VDDA)
X32_N: C23.1 U1.9(PC15-OSC32_OUT) Y2.2(Out/In)
X32_P: C22.1 U1.8(PC14-OSC32_IN) Y2.1(In/Out)
X_N: C19.2 U1.13(PH1-OSC_OUT) Y1.1
X_P: C18.2 U1.12(PH0-OSC_IN) Y1.3
NetC10_2: C10.2 C11.2 U1.48(VCAP)
NetC12_2: C12.2 C13.2 U1.73(VCAP)
NetD1_1: D1.1(K) R7.2
NetD1_4: D1.4(K) R8.2
NetD2_1: D2.1(K) R11.2
NetD2_4: D2.4(K) R14.2
NetR9_2: R9.2 SW1.1
NetR10_2: R10.2 SW2.1

Not connected (* = marked no-connect by the designer): J4 07* 08* 09*; U1 1(PE2) 2(PE3) 3(PE4) 4(PE5) 5(PE6) 7(PC13) 15(PC0) 16(PC1) 17(PC2_C) 18(PC3_C) 25(PA3) 28(PA4) 55(PD8) 56(PD9) 57(PD10) 58(PD11) 77(PA15) 78(PC10) 79(PC11) 80(PC12) 90(PB4) 91(PB5) 96(PB9) 97(PE0) 98(PE1)

### Layout directives
differential pair: X32_N, X32_P, X_N, X_P

### Notes on the sheet
- SERCOMS CHECKED
- VOLTAGE SENSE + CAN
- CHECK IF STM32H730 HAS TIMERS ON THESE PINS - IT DO
- MAR 12, 2024 - SAME AS SERCOM CHECK
- added 100n cap here
- disconnected 3V3 and added TPs
- CHANGED VDDA
- Status LEDs
- Debug interface
- Boot switch
- Reset switch
- (near C19) Crystals
- (near J4) 10-pin JTAG header (J-link EDU compatible)
- UPDATED BUZZ LED
- UNLABELLED RESISTORS ARE JUMPERS

### Library data of the parts
C1 C20 C21 = CMP-2008-02046-2: CAP CER 0.1UF 10V X5R 0402; Manufacturer: Kemet; Material: Ceramic; Capacitance: 0.10 μF; Temperature Coefficient: 15%; Tolerance: 0.1; Value: 0.10 μF; Package: C0402-BB; Temperature: -55°C to +125°C; ComponentLink2Description: Datasheet; Temperature Characteristic: X5R; Device Class L1: Passive Components; Height: 0.55mm; Lead Free: Yes; ComponentLink2URL: https://content.kemet.com/datasheets/KEM_C1002_X7R_SMD.pdf; Device Class L2: Capacitors; Temperature Range Low: -55°C; Temperature Range High: +125°C; RoHS: TRUE; Octopart: https://octopart.com/c0402c104k8pactu-kemet-140039; Automotive: No; Mouser Description: Capacitor 100 nF 10 VDC 0402; Category: Cap; Voltage Rating: 10 V; Digikey Description: CAP CER 0.1UF 10V X5R 0402; Ipc Land Pattern Name: CAPC10050X50; Device Class L3: Ceramic Capacitors; Manufacturer Part Number: C0402C104K8PACTU
C2 = CMP-2000-05997-2: CAP CER 4.7UF 10V X5R 0402; Dielectric Material: Ceramic; Tolerance: 10%; Series: C; Package Quantity: 10000; Max Operating Temperature: 85°C; Case Code (Imperial): 0402; Lead Free: Lead Free; Voltage Rating (DC): 10V; Packaging: Cut Tape; Voltage Rating: 10V; Min Operating Temperature: -55°C; Dielectric: X5R; Thickness: 0.022inch; Width: 0.02inch; Case/Package: 0402; Case Code (Metric): 1005; Capacitance: 4.7uF; Length: 0.039inch; RoHS Compliant: Yes; REACH SVHC: No SVHC; Mount: Surface Mount
C3-C7 C9 C11 C13 C15 C17 = CMP-2100-03641-2: CAP CER 0.1UF 16V X7R 0402; Manufacturer: Murata; Standoff Height: 0mm; Tolerance: 10%; Voltage Rating: 16Vdc; Material: Ceramic; Capacitance: 0.10μF; Value: 0.10μF; RoHS: TRUE; Manufacturer Part Number: GRM155R71C104KA88D; Temperature Characteristic: X7R; Octopart: https://octopart.com/grm155r71c104ka88d-murata-196880; Digikey Description: CAP CER 0.1UF 16V X7R 0402; Device Class L3: Ceramic Capacitors; Height: 0.55mm; ComponentLink2Description: Datasheet; Temperature Range Low: -55°C; Ipc Land Pattern Name: CAPC10050X219; ComponentLink2URL: https://search.murata.co.jp/Ceramy/image/img/A01X/G101/ENG/GRM155R71H471KA01-01A.pdf; Device Class L1: Passive Components; Lead Free: yes; Category: Cap; Package: GRM15; Temperature: -55°C to +125°C; Device Class L2: Capacitors; Temperature Range High: +125°C; Mouser Description: 0402 0.1 uF 16V ±10 % Tolerance X7R SMT Multilayer Ceramic Capacitor
C8 C14 C16 = CMP-14477-000104-2: None; Tolerance: 10%; Voltage Rating: 16V; Dielectric: X5R; Capacitance: 1uF; Packaging: Tape and Reel; Depth: 0.5mm; Mount: Surface Mount; Thickness: 0.022inch; Package Quantity: 1; Min Operating Temperature: -55°C; Series: M; Voltage Rating (DC): 16V; Termination: SMD/SMT; Case/Package: 0402; Number of Pins: 2; Case Code (Imperial): 0402; Length: 1mm; Halogen Free: Halogen Free; Case Code (Metric): 1005; Width: 0.02inch; RoHS Compliant: Yes; Radiation Hardening: No; Max Operating Temperature: 85°C; Height: 0.5mm; Construction: Flat
C10 C12 = CMP-08246-004344-1: CAP CER 2.2UF 10V X7S 0402; Dielectric Material: Ceramic; Tolerance: 10%; Mount: Surface Mount; Height: 0.5mm; Package Quantity: 1; Depth: 0.5mm; RoHS Compliant: Yes; Length: 1mm; Thickness: 0.022inch; Packaging: Tape and Reel; Capacitance: 2.2uF; Case Code (Imperial): 0402; Resistor Type: Ceramic; Dielectric: X7S; Case/Package: 0402; Min Operating Temperature: -55°C; Voltage Rating: 10V; Series: C; Weight: 2.3E-05oz; Width: 0.02inch; Voltage Rating (DC): 10V; Case Code (Metric): 1005; Max Operating Temperature: 125°C; Termination: SMD/SMT; Lead Free: Lead Free
C18 C19 = CMP-1036-00709-3: General Purpose Ceramic Capacitor, 0805, 6.8pF, 0.25pF, C0G, 30ppm/°C, 100V; Dissipation Factor: 10%; Insulation Resistance: 100GR; Tolerance: 5%; Max Operating Temperature: 125°C; RoHS Compliant: Yes; Capacitance: 6.8pF; Termination: SMD/SMT; Number of Pins: 2; Packaging: Tape and Reel; Mount: Surface Mount; Case Code (Metric): 2012; Case Code (Imperial): 0805; Height: 0.71mm; Min Operating Temperature: -55°C; Width: 0.049inch; Temperature Coefficient: 0ppm/°C; Length: 2.01mm; Dielectric: C0G; Series: -; Voltage Rating (DC): 100V; Dielectric Material: Ceramic; Depth: 1.25mm; Contact Plating: Tin; Voltage Rating: 100V; Thickness: 0.037inch; Case/Package: 0805; Lead Free: Lead Free; Radiation Hardening: No; Voltage: 100V; Construction: Flat; Package Quantity: 1; REACH SVHC: No SVHC
C22 C23 = CMP-2008-02590-2: General Purpose Ceramic Capacitor, 0402, 18pF, 1%, C0G, 30ppm/°C, 50V; Depth: 0.5mm; Packaging: Tape and Reel; Number of Pins: 2; Tolerance: 1%; Min Operating Temperature: -55°C; Capacitance: 18pF; Termination: SMD/SMT; Lead Free: Lead Free; Case Code (Metric): 1005; Radiation Hardening: No; Package Quantity: 1; Max Operating Temperature: 125°C; Voltage Rating: 50V; Construction: Flat; Dielectric: C0G; Length: 1mm; REACH SVHC: No SVHC; Case Code (Imperial): 0402; Series: -; RoHS Compliant: Yes; Voltage Rating (DC): 50V; Mount: Surface Mount; Case/Package: 0402; Width: 0.5mm; Thickness: 0.022inch; Contact Plating: Tin
D1 D2 = CMP-004-00040-2: Led, Red/Grn, 180Mcd/230Mcd, 624Nm/525Nm Rohs Compliant: Yes; Source: rgled.SchLib; Component Type: Standard; Design Item ID: CMP-004-00034-2; Pins: 4
FB1 = CMP-0686-00252-4: Chip Ferrite Bead, 0402, 600Ω @ 100MHz, 0.23Ω, 25%, 900mA; Number of Circuits: 1; Impedance: 600R; DC Resistance (DCR): 230mR; Material: Steel; Length: 1mm; Package Quantity: 10000; Height: 0.5mm; Width: 0.5mm; Max DC Current: 900mA; Number of Lines: 1; Termination: SMD/SMT; Packaging: Tape and Reel; Lead Free: Lead Free; Min Operating Temperature: -55°C; Max Operating Temperature: 125°C; Max Current Rating: 900mA; Case Code (Imperial): 0402; Number of Pins: 2; Current Rating: 900mA; Test Frequency: 100MHz; Case/Package: 0402; Tolerance: 25%; Case Code (Metric): 1005
J4 = CMP-002-00041-5: Board Connector, 10 Contact(s), 2 Row(s), Male, Right Angle, 0.05 inch Pitch, Surface Mount Terminal, Locking, Black Insulator; Connector Type: BOARD CONNECTOR; Mounting Technology: Board; RoHS Compliant: Yes
R5 R12 R13 = CMP-1012-00623-3: Chip Resistor, 10 KOhm, +/- 1%, 0.1 W, -55 to 155 degC, 0603 (1608 Metric), RoHS, Tape and Reel; Manufacturer: Panasonic; Voltage Rating: 75V; Case\/Package: 0603; Power Rating: 100mW; Resistance: 10KOhm; Temperature Coefficient: 100ppm\/degreesC; Number of Pins: 2; Package Reference: 603; Depth: 0.8mm; Mount: SurfaceMount; Package Description: 2-Pin Surface Mount Device, Body 1.6 x 0.85 mm; Datasheet Version: 02/2017; Length: 1.6mm; Lead Free: LeadFree; Height: 0.45mm; Number of Terminations: 2; Max Power Dissipation: 100mW; Min Operating Temperature: -55degC; Datasheet URL: https://industrial.panasonic.com/cdbs/www-data/pdf/RDA0000/AOA0000C304.pdf; Termination: SMD/SMT; Case Code (Metric): 1608; Case Code (Imperial): 0603; Tolerance: 1%; Max Operating Temperature: 155degC; RoHSCompliant: true; Voltage Rating (DC): 75V; Radiation Hardening: No; Packaging: TapeandReel; Composition: ThickFilm; Mounting Technology: SurfaceMount; Manufacturer URL: http://www.panasonic.com/; Width: 0.031inch; REACH SVHC: NoSVHC; Contact Plating: Tin; Military Standard: Not; Package Quantity: 1
R7 R8 R11 R14 = CMP-2000-00572-1: Manufacturer: Panasonic; Part Number: ERJ3EKF56R0V
R9 R10 = CMP-2000-00435-2: Chip Resistor, 330 Ohm, +/- 1%, 0.1 W, -55 to 155 degC, 0603 (1608 Metric), RoHS, Tape and Reel; Gender: Male; Mating Cycles: 10000; Current Rating: 500 mA; Voltage Rating: 10 V; REACH SVHC: No SVHC; PackageDescription: 2-Pin Surface Mount Device, Body 1.6 x 0.85 mm; Contact Finish: Gold; Pins: 8; ComponentLink1Description: Manufacturer URL; Packaging: Tape and Reel; Max Operating Temperature: 85 degC; Contact Material: Copper; Height: 1.45 mm; Width: 1.45 mm; DatasheetVersion: Apr-15; Package Quantity: 1500; Contact Plating: Gold; PackageReference: 0603; Mount: Surface Mount; Lead Pitch: 1.1 mm; Min Operating Temperature: -25 degC; ComponentLink1URL: http://www.panasonic.com/; ComponentLink2URL: http://industrial.panasonic.com/cdbs/www-data/pdf/RDA0000/AOA0000C86.pdf; Length: 13.7 mm; ComponentLink2Description: Datasheet; RoHSCompliant: true
SW1 SW2 = CMP-10040-000029-1: SWITCH TACTILE SPST-NO 0.02A 15V; Operating Force: 240gf; Switch Travel: 0.13mm; Illumination Type: Non-Illuminated; Throw Configuration: SPST; Number of Ports: 1; Current Rating: 5A; Mechanical Life: 500000Cycles; Switch Function: Off-Mom; Connector Type: USB; Actuator Type: Standard; Gender: Receptacle; Number of Contacts: 24; Contact Plating: Gold; Insulation Color: Black; Min Operating Temperature: -40°C; Packaging: Tape and Reel; Flammability Rating: UL94 V-0; Max Operating Temperature: 85°C; Termination: Solder; Mount: Surface Mount
U1 = CMP-12105-000107-1: IC MCU 32BIT 128KB FLASH 100LQFP
Y1 = CMP-27762-011708-1: Crystal 48MHz ±20ppm 18pF SMD-4 3.2mm x 2.5mm; Series Resistance: 35R; Frequency Stability: 50ppm; Package Quantity: 1000; Packaging: Tape and Reel; Mount: Surface Mount; Length: 3.2mm; Load Capacitance: 18pF; Max Operating Temperature: 70°C; Operating Frequency: 48 MHz; RoHS Compliant: Yes; Series: ABM8; Frequency Tolerance: 20ppm; Lead Free: Lead Free; Min Operating Temperature: -20°C; Case/Package: CSMD; Number of Pins: 4; Height: 0.031inch; ESR (Equivalent Series Resistance): 35R; Frequency: 48MHz; Radiation Hardening: No; Width: 0.098inch; Tolerance: 20ppm; Termination: SMD/SMT; Depth: 2.5mm; Resistor Type: Ceramic; REACH SVHC: No SVHC
Y2 = CMP-40224-000006-1: CRYSTAL 32.7680KHZ 12.5PF SMD; Manufacturer: ECS International; Frequency: 32.768kHz; Esr: 90kΩ; Tolerance: 20ppm; Device Class L1: Passive Components; Load Capacitance: 12.5pF; Temperature: -40°C to +85°C; ComponentLink2URL: https://ecsxtal.com/store/pdf/ECX-1210.pdf; Series: ECX-1210; Octopart: https://octopart.com/ecs-.327-12.5-1210-tr-ecs+international-81221340; ComponentLink2Description: Datasheet; Temperature Range Low: -40°C; Digikey Description: CRYSTAL 32.7680KHZ 12.5PF SMD; Lead Free: Yes; RoHS: TRUE; Device Class L3: Crystals; Automotive: No; Category: Crys; Height: 0.5mm; Manufacturer Part Number: ECS-.327-12.5-1210-TR; Temperature Range High: +85°C; Device Class L2: Crystals / Oscillators; Package: ECX-1210

## Sheet PWR_MGMT.SchDoc
size A4; SheetNumber: 4; SheetTotal: 5
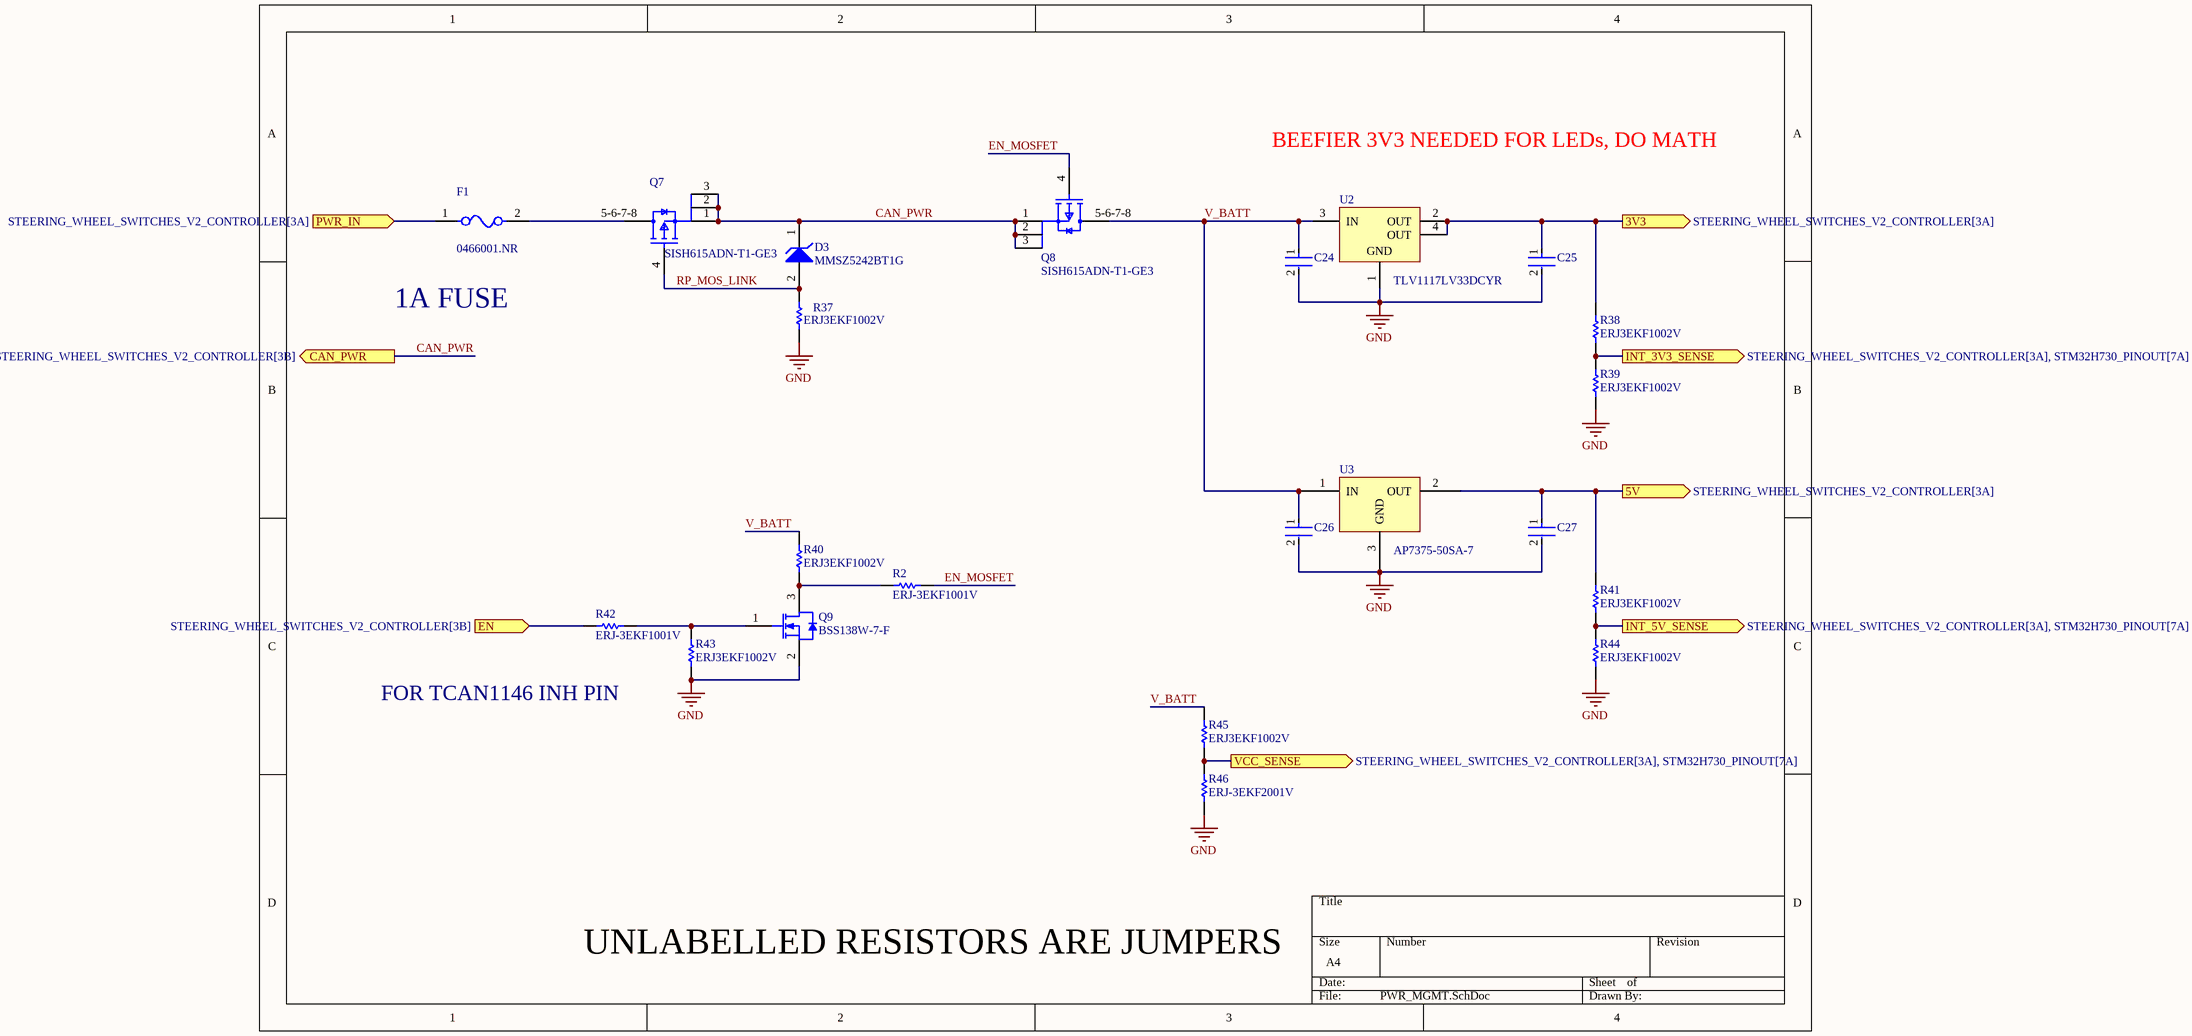
[diagram p7: PWR_MGMT.SchDoc]

### Parts
C24  GRM188R61E106KA73D  [FP-GRM188-0_2-IPC_A]  (value not drawn)
C25  GRM188R61E106KA73D  [FP-GRM188-0_2-IPC_A]  (value not drawn)
C26  GRM188R61E106KA73D  [FP-GRM188-0_2-IPC_A]  (value not drawn)
C27  GRM188R61E106KA73D  [FP-GRM188-0_2-IPC_A]  (value not drawn)
D3  MMSZ5242BT1G  [ONSC-SOD-123-2-425-04_V]
F1  0466001.NR  [FP-0466-MFG]
Q7  SISH615ADN-T1-GE3  [SISH615ADN-T1-GE3-Footprint-1]
Q8  SISH615ADN-T1-GE3  [SISH615ADN-T1-GE3-Footprint-1]
Q9  BSS138W-7-F  [DIOD-SOT323-3_V]
R2  ERJ-3EKF1001V  [RESC1608X55X30LL15T15]
R37  ERJ3EKF1002V  [RESC1609X55X30LL15T15]
R38  ERJ3EKF1002V  [RESC1609X55X30LL15T15]
R39  ERJ3EKF1002V  [RESC1609X55X30LL15T15]
R40  ERJ3EKF1002V  [RESC1609X55X30LL15T15]
R41  ERJ3EKF1002V  [RESC1609X55X30LL15T15]
R42  ERJ-3EKF1001V  [RESC1608X55X30LL15T15]
R43  ERJ3EKF1002V  [RESC1609X55X30LL15T15]
R44  ERJ3EKF1002V  [RESC1609X55X30LL15T15]
R45  ERJ3EKF1002V  [RESC1609X55X30LL15T15]
R46  ERJ-3EKF2001V  [RESC1608X55X30ML15T15]
U2  TLV1117LV33DCYR  [DCY0004A_N]
U3  AP7375-50SA-7  [AP7375-50SA-7-Footprint-1]

### Ports
3V3 (out, see STEERING_WHEEL_SWITCHES_V2_CONTROLLER[3A]), 5V (out, see STEERING_WHEEL_SWITCHES_V2_CONTROLLER[3A]), CAN_PWR (out, see STEERING_WHEEL_SWITCHES_V2_CONTROLLER[3B]), EN (in, see STEERING_WHEEL_SWITCHES_V2_CONTROLLER[3B]), INT_3V3_SENSE (out, see STEERING_WHEEL_SWITCHES_V2_CONTROLLER[3A], STM32H730_PINOUT[7A]), INT_5V_SENSE (out, see STEERING_WHEEL_SWITCHES_V2_CONTROLLER[3A], STM32H730_PINOUT[7A]), PWR_IN (in, see STEERING_WHEEL_SWITCHES_V2_CONTROLLER[3A]), VCC_SENSE (out, see STEERING_WHEEL_SWITCHES_V2_CONTROLLER[3A], STM32H730_PINOUT[7A])

### Nets
3V3: C25.1 R38.2 U2.2(OUT) U2.4(OUT) ; port 3V3
5V: C27.1 R41.2 U3.2(OUT) ; port 5V
GND: C24.2 C25.2 C26.2 C27.2 Q9.2(S) R37.2 R39.1 R43.1 R44.2 R46.1 U2.1(GND) U3.3(GND)
CAN_INH: R42.2 ; port EN
CAN_PWR: D3.1(K) Q7.1(S) Q7.2(S) Q7.3(S) Q8.1(S) Q8.2(S) Q8.3(S) ; port CAN_PWR
EN_MOSFET: Q8.4(G) R2.1
INT_3V3_SENSE: R38.1 R39.2 ; port INT_3V3_SENSE
INT_5V_SENSE: R41.1 R44.1 ; port INT_5V_SENSE
PWR_IN: F1.1 ; port PWR_IN
RP_MOS_LINK: D3.2(A) Q7.4(G) R37.1
V_BATT: C24.1 C26.1 Q8.5-6-7-8(D) R40.2 R45.2 U2.3(IN) U3.1(IN)
VCC_SENSE: R45.1 R46.2 ; port VCC_SENSE
NetF1_2: F1.2 Q7.5-6-7-8(D)
NetQ9_1: Q9.1(G) R42.1 R43.2
NetQ9_3: Q9.3(D) R2.2 R40.1

### Notes on the sheet
- BEEFIER 3V3 NEEDED FOR LEDs, DO MATH
- 1A FUSE
- FOR TCAN1146 INH PIN
- UNLABELLED RESISTORS ARE JUMPERS

### Library data of the parts
C24-C27 = CMP-06035-045268-1: Chip Multilayer Ceramic Capacitors for General Purpose, 0603, 10uF, X5R, 15%, 10%, 25V; Case/Package: 0603
D3 = CMP-1060-00565-1: Zener Voltage Regulator, 500 mW, 2-Pin SOD-123, Pb-Free, Tape and Reel; Manufacturer: On Semiconductor; P Max (W): 0.5; VZ Typ (V): 12; PartNumber: MMSZ5242BT1G; PackageReference: SOD-123-2-425-04; ComponentLink3URL: http://www.onsemi.com/pub_link/Collateral/425-04.PDF; Mounting Technology: Surface Mount; ComponentLink2Description: Datasheet; ComponentLink1URL: http://www.onsemi.com/; ComponentLink3Description: Package Specification; PackageDescription: 2-Pin SOD, Body 1.6 x 2.69 mm; PackageVersion: Rev. G, 10/2009; ComponentLink1Description: Manufacturer URL; RoHS: Pb-Free; ComponentLink2URL: http://www.onsemi.com/pub_link/Collateral/MMSZ5221BT1-D.PDF; Packing: Tape and Reel; DatasheetVersion: Rev. 12
F1 = CMP-08605-000058-1: FUSE BOARD MNT 1A 63VAC/VDC 1206; Manufacturer: Littelfuse Inc; Max Fuse Dc Voltage: 63V; Fuse Interrupt Ac Current: 50A; Fuse Voltage Drop: 79.97mV; Resistance: 0.075Ω; Value: 0.075Ω; Fuse I2T: 0.0423A2Sec; Fuse Blow Speed: Fast; Temperature Range High: +90°C; Max Fuse Ac Voltage: 63V; Manufacturer Part Number: 0466001.NR; Package: 0466; ComponentLink2URL: https://www.littelfuse.com/~/media/electronics/datasheets/fuses/littelfuse_fuse_466_datasheet.pdf.pdf; Device Class L3: unset; Lead Free: Yes; Automotive: No; Digikey Description: FUSE BOARD MNT 1A 63VAC/VDC 1206; Height: 0.66mm; Temperature Range Low: -55°C; Category: Fuse; ComponentLink2Description: Datasheet; Device Class L1: Circuit Protection; Device Class L2: Fuses; Fuse Current: 1A; Mouser Description: Surface Mount Fuses 63V FA 1206 1A VFA Slimline; Octopart: https://octopart.com/0466001.nr-littelfuse-566005; Fuse Interrupt Dc Current: 50A; RoHS: TRUE; Voltage Rating: 63V; Temperature: -55°C to +90°C
Q7 Q8 = CMP-013-00018-2: Trans MOSFET P-CH 20V 22.1A 8-Pin PowerPAK 1212 EP T/R; Source: SISH615ADN-T1-GE3.SchLib; Design Item ID: CMP-013-00036-4; Component Type: Standard; Pins: 5
Q9 = CMP-2000-05968-1: N-Channel Enhancement Mode Mosfet, 50 V, 200 mA, -55 to 150 degC, 6-Pin SOT-323, RoHS, Tape and Reel; Typical Turn-Off Delay Time: 20ns; Number of Channels: 1Channel; Type: EnhancementModeFieldEffectTransistor; Brand: DiodesIncorporated; Vds - Drain-Source Breakdown Voltage: 75V; Vgs - Gate-Source Voltage: 20V; Rds On - Drain-Source Resistance: 1.4Ohms; Transistor Type: 1N-Channel; Configuration: Single; Unit Weight: 0.000212oz; Pd - Power Dissipation: 200mW; Id - Continuous Drain Current: 200mA; Forward Transconductance - Min: 0.1S; Manufacturer URL: http://www.diodes.com/; Series: BSS138; Package Description: 3-Pin Small Outline Transistor, Body 2 x 1.25 mm, Pitch 0.65 mm; Mounting Technology: SurfaceMount; Product Category: MOSFET; RoHS: True; Maximum Operating Temperature: +150C; Height: 1mm; Length: 2.2mm; Technology: Si; Width: 1.35mm; Datasheet URL: http://www.diodes.com/_files/datasheets/ds30206.pdf; Manufacturer: DiodesIncorporated; Package / Case: SOT-323-3; Typical Turn-On Delay Time: 20ns; Transistor Polarity: N-Channel; Factory Pack Quantity: 3000; Packaging: Reel; Product: MOSFETSmallSignal; Datasheet Version: Rev. 11-2, 09/2013; Package Reference: SOT323; Minimum Operating Temperature: -55C; Mounting Style: SMD/SMT; Channel Mode: Enhancement
R2 R42 = CMP-2000-00180-1: Manufacturer: Panasonic; Part Number: ERJ-3EKF1001V
R37-R41 R43-R45 = CMP-1012-00623-3: as R5 on sheet STM32H730_PINOUT; Number of Pins: 2; Package Reference: 603; Depth: 0.8mm; Mount: SurfaceMount; Package Description: 2-Pin Surface Mount Device, Body 1.6 x 0.85 mm; Datasheet Version: 02/2017; Length: 1.6mm; Lead Free: LeadFree; Height: 0.45mm; Number of Terminations: 2; Max Power Dissipation: 100mW; Min Operating Temperature: -55degC; Datasheet URL: https://industrial.panasonic.com/cdbs/www-data/pdf/RDA0000/AOA0000C304.pdf; Termination: SMD/SMT; Case Code (Metric): 1608; Case Code (Imperial): 0603; Tolerance: 1%; Max Operating Temperature: 155degC; RoHSCompliant: true; Voltage Rating (DC): 75V; Radiation Hardening: No; Packaging: TapeandReel; Composition: ThickFilm; Mounting Technology: SurfaceMount; Manufacturer URL: http://www.panasonic.com/; Width: 0.031inch; REACH SVHC: NoSVHC; Contact Plating: Tin; Military Standard: Not; Package Quantity: 1
R46 = CMP-2000-00317-1: Manufacturer: Panasonic; Part Number: ERJ-3EKF2001V
U2 = CMP-0395-00503-2: Single Output LDO, 1 A, Fixed 3.3 V Output, 2 to 5.5 V Input, 4-pin SOT-223 (DCY), -40 to 125 degC, Green (RoHS & no Sb/Br); Manufacturer: Texas Instruments; Vout Adj(Min)(V): 3.3; Vdo(Typ)(mV): 1200; Iq(Typ)(mA): 0.05; Accuracy(%): 2; Iout(Max)(A): 1; SubFamily: Single Channel LDO; Vin(Max)(V): 5.5; PackageReference: DCY0004A; PackageDescription: 4-Pin Plastic Small Outline, Body 3.5 x 6.5 mm, Pitch 2.3 mm; Vout Adj(Max)(V): 3.3; Mounting Technology: Surface Mount; ComponentLink2Description: Datasheet; ComponentLink1Description: Manufacturer URL; PartNumber: TLV1117LV33DCYR; ComponentLink3Description: Package Specification; ComponentLink1URL: http://www.ti.com/; ComponentLink2URL: http://www.ti.com/general/docs/lit/getliterature.tsp?genericPartNumber=TLV1117LV33&fileType=pdf; Fixed Output Options(V): 3.3; PackageVersion: 4202506/B; Vin(Min)(V): 2; DatasheetVersion: SBVS160A; Eco-Plan: Green (RoHS & no Sb/Br); ComponentLink3URL: http://www.ti.com/litv/pdf/mpds094a; Code_JEDEC: TO-261
U3 = CMP-019-00041-1: Ldo Cmos Lowcurr SOT23 T&r 3K

## Sheet CAN_IF.SchDoc
size B; SheetNumber: 5; SheetTotal: 5
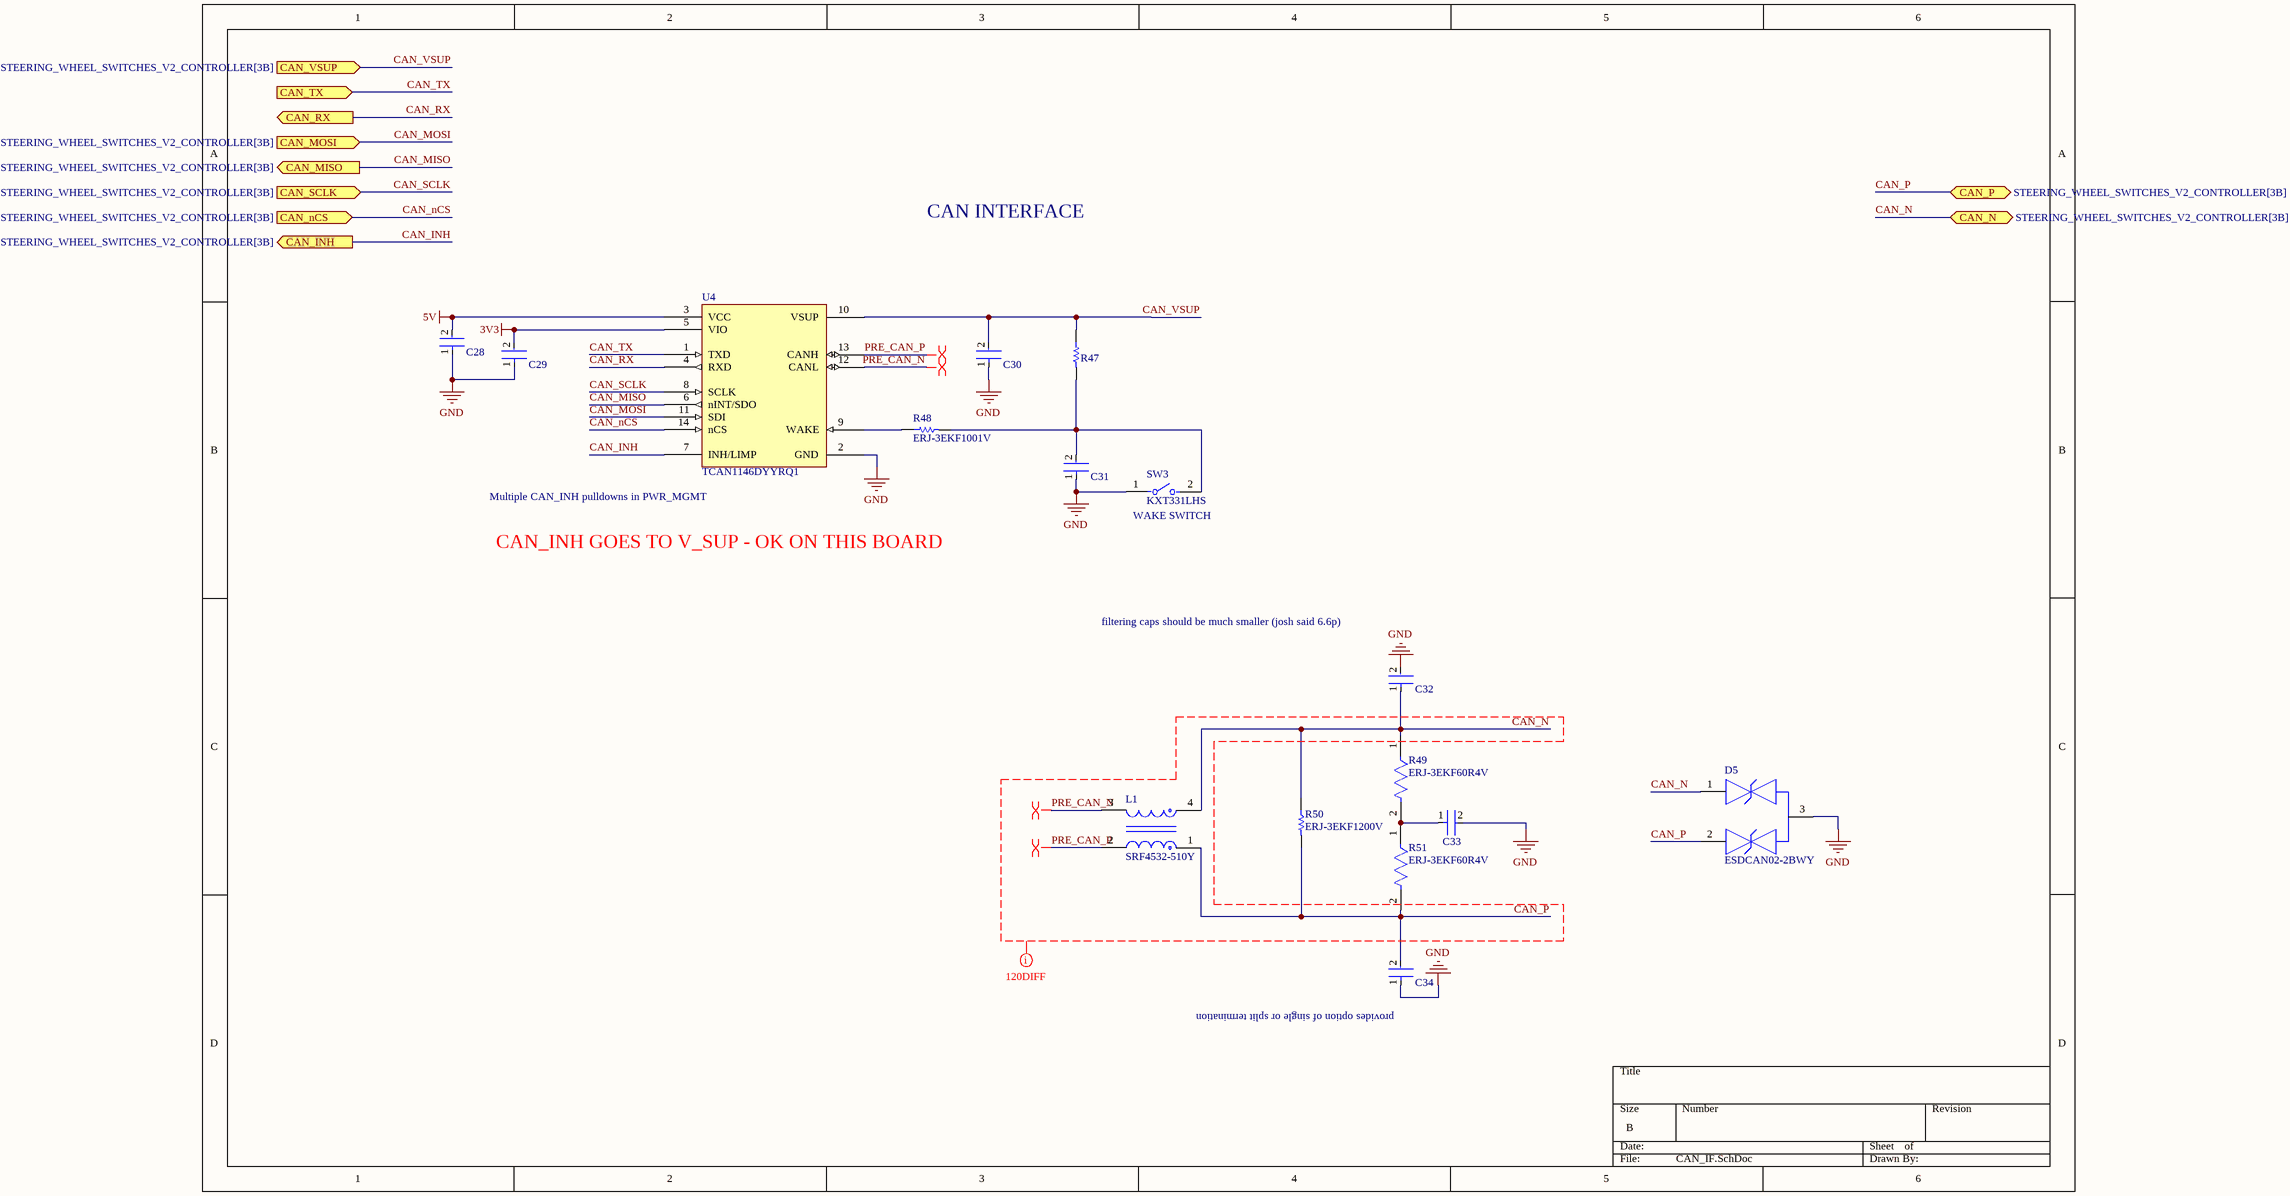
[diagram p8: CAN_IF.SchDoc]

### Parts
C28  C0402C104K8PACTU  [FP-C0402-BB-MFG]  (value not drawn)
C29  C0402C104K8PACTU  [FP-C0402-BB-MFG]  (value not drawn)
C30  C0402C104K8PACTU  [FP-C0402-BB-MFG]  (value not drawn)
C31  C0402C104K8PACTU  [FP-C0402-BB-MFG]  (value not drawn)
C32  C0402C104K8PACTU  [FP-C0402-BB-MFG]  (value not drawn)
C33  C0402C104K8PACTU  [FP-C0402-BB-MFG]  (value not drawn)
C34  C0402C104K8PACTU  [FP-C0402-BB-MFG]  (value not drawn)
D5  ESDCAN02-2BWY  [FP-SOT323-3L-MFG]
L1  SRF4532-510Y  [FP-SRF4532-MFG]
R47  ERJ3EKF1002V  [RESC1609X55X30LL15T15]  (value not drawn)
R48  ERJ-3EKF1001V  [RESC1608X55X30LL15T15]
R49  ERJ-3EKF60R4V  [FP-ERJ3EK-IPC_C]
R50  ERJ-3EKF1200V  [RESC1609X55X30ML15T15]
R51  ERJ-3EKF60R4V  [FP-ERJ3EK-IPC_C]
SW3  KXT331LHS  [FP-KXT331LHS-MFG]
U4  TCAN1146DYYRQ1  [TCAN1146DYYRQ1-Footprint-1]

### Ports
CAN_INH (out, see STEERING_WHEEL_SWITCHES_V2_CONTROLLER[3B]), CAN_MISO (out, see STEERING_WHEEL_SWITCHES_V2_CONTROLLER[3B]), CAN_MOSI (in, see STEERING_WHEEL_SWITCHES_V2_CONTROLLER[3B]), CAN_N (bidir, see STEERING_WHEEL_SWITCHES_V2_CONTROLLER[3B]), CAN_nCS (in, see STEERING_WHEEL_SWITCHES_V2_CONTROLLER[3B]), CAN_P (bidir, see STEERING_WHEEL_SWITCHES_V2_CONTROLLER[3B]), CAN_RX (out), CAN_SCLK (in, see STEERING_WHEEL_SWITCHES_V2_CONTROLLER[3B]), CAN_TX (in), CAN_VSUP (in, see STEERING_WHEEL_SWITCHES_V2_CONTROLLER[3B])

### Nets
3V3: C29.2 U4.5(VIO)
5V: C28.2 U4.3(VCC)
GND: C28.1 C29.1 C30.1 C31.1 C32.2 C33.2 C34.1 D5.3 SW3.1 U4.2(GND)
CAN_INH: U4.7(INH/LIMP) ; port CAN_INH
CAN_MISO: U4.6(nINT/SDO) ; port CAN_MISO
CAN_MOSI: U4.11(SDI) ; port CAN_MOSI
CAN_N: C32.1 D5.1 L1.4 R49.1 R50.1 ; port CAN_N
CAN_nCS: U4.14(nCS) ; port CAN_nCS
CAN_P: C34.2 D5.2 L1.1 R50.2 R51.2 ; port CAN_P
CAN_RX: U4.4(RXD) ; port CAN_RX
CAN_SCLK: U4.8(SCLK) ; port CAN_SCLK
CAN_TX: U4.1(TXD) ; port CAN_TX
CAN_VSUP: C30.2 R47.1 U4.10(VSUP) ; port CAN_VSUP  [project net CAN_PWR]
PRE_CAN_N: L1.3 U4.12(CANL)
PRE_CAN_P: L1.2 U4.13(CANH)
NetC31_2: C31.2 R47.2 R48.2 SW3.2
NetC33_1: C33.1 R49.2 R51.1
NetR48_1: R48.1 U4.9(WAKE)

### Layout directives
differential pair: PRE_CAN_N, PRE_CAN_P
net class 120DIFF: CAN_N, CAN_P, PRE_CAN_N, PRE_CAN_P

### Notes on the sheet
- CAN INTERFACE
- (near U4) Multiple CAN_INH pulldowns in PWR_MGMT
- (near SW3) WAKE SWITCH
- CAN_INH GOES TO V_SUP - OK ON THIS BOARD
- (near C32) filtering caps should be much smaller (josh said 6.6p)
- (near C34) provides option of single or split termination

### Library data of the parts
C28-C34 = CMP-2008-02046-2: as C1 on sheet STM32H730_PINOUT; Package: C0402-BB; Temperature: -55°C to +125°C; ComponentLink2Description: Datasheet; Temperature Characteristic: X5R; Device Class L1: Passive Components; Height: 0.55mm; Lead Free: Yes; ComponentLink2URL: https://content.kemet.com/datasheets/KEM_C1002_X7R_SMD.pdf; Device Class L2: Capacitors; Temperature Range Low: -55°C; Temperature Range High: +125°C; RoHS: TRUE; Octopart: https://octopart.com/c0402c104k8pactu-kemet-140039; Automotive: No; Mouser Description: Capacitor 100 nF 10 VDC 0402; Category: Cap; Voltage Rating: 10 V; Digikey Description: CAP CER 0.1UF 10V X5R 0402; Ipc Land Pattern Name: CAPC10050X50; Device Class L3: Ceramic Capacitors; Manufacturer Part Number: C0402C104K8PACTU
D5 = CMP-12225-000055-1: TVS DIODE 26.5V 44V SOT323-3; Manufacturer: STMicroelectronics; Value: 3pF; Direction: Bidirectional; Breakdown Voltage: 28.5V; Automotive Grade: Grade 0; Standoff Height: 0mm; Peak Pulse Power: 170W; Peak Pulse Current: 3A; Number Of Channels: 2; Max Junction Temp: +175°C; Mouser Description: TVS Diodes / ESD Suppressors Automotive dual-line Transil, Transient voltage suppressor (TVS) for CAN bus; Height: 1.1mm; Category: Diode; Reverse Standoff Voltage: 26.5V; Device Class L1: Circuit Protection; Temperature: -55°C to +175°C; RoHS: TRUE; ComponentLink2URL: https://www.st.com/resource/en/datasheet/esdcan02-2bwy.pdf; Device Class L3: unset; Device Class L2: TVS Diodes; Temperature Range High: +175°C; Octopart: https://octopart.com/esdcan02-2bwy-stmicroelectronics-58631133; Ipc Land Pattern Name: SOT65P210X95-3; Temperature Range Low: -55°C; Capacitance: 3pF; Digikey Description: TVS DIODE 26.5V 44V SOT323-3; Automotive: Yes; ComponentLink2Description: Datasheet; Clamping Voltage: 44V; Manufacturer Part Number: ESDCAN02-2BWY; Lead Free: Yes; Package: SOT323-3L
L1 = CMP-07251-000006-1: CMC 51UH 200MA 2LN 2KOHM SMD; Element Configuration: Dual; Number of Lines: 2; Core Material: Ferrite; Impedance: 2kR; Test Frequency: 100kHz; Voltage Rating (DC): 50V; Insulation Resistance: 10MR; Material: Steel; Tolerance: 50%; DC Resistance (DCR): 3.5R; RoHS Compliant: Yes; Mount: Surface Mount; REACH SVHC: No SVHC; Termination: SMD/SMT; DC Current: 200mA; Current: 200mA; Lead Free: Lead Free; Contact Plating: Tin; Length: 4.5mm; Max DC Current: 200mA; Width: 0.126inch; Case/Package: 4532; Packaging: Tape and Reel; Package Quantity: 1; Min Operating Temperature: -40°C; Depth: 3.4mm; Series: SRF4532; Max Operating Temperature: 125°C; Current Rating: 200mA; Self Resonant Frequency: 100kHz; Height: 0.118inch; Inductance: 51uH; Resistance: 2kR
R47 = CMP-1012-00623-3: as R5 on sheet STM32H730_PINOUT; Number of Pins: 2; Package Reference: 603; Depth: 0.8mm; Mount: SurfaceMount; Package Description: 2-Pin Surface Mount Device, Body 1.6 x 0.85 mm; Datasheet Version: 02/2017; Length: 1.6mm; Lead Free: LeadFree; Height: 0.45mm; Number of Terminations: 2; Max Power Dissipation: 100mW; Min Operating Temperature: -55degC; Datasheet URL: https://industrial.panasonic.com/cdbs/www-data/pdf/RDA0000/AOA0000C304.pdf; Termination: SMD/SMT; Case Code (Metric): 1608; Case Code (Imperial): 0603; Tolerance: 1%; Max Operating Temperature: 155degC; RoHSCompliant: true; Voltage Rating (DC): 75V; Radiation Hardening: No; Packaging: TapeandReel; Composition: ThickFilm; Mounting Technology: SurfaceMount; Manufacturer URL: http://www.panasonic.com/; Width: 0.031inch; REACH SVHC: NoSVHC; Contact Plating: Tin; Military Standard: Not; Package Quantity: 1
R48 = CMP-2000-00180-1: Manufacturer: Panasonic; Part Number: ERJ-3EKF1001V
R49 R51 = CMP-1012-00372-3: RES SMD 60.4 OHM 1% 1/10W 0603; Resistance: 60.4R; Voltage Rating (DC): 50V; Voltage Rating: 75V; Temperature Coefficient: 100ppm/°C; Power Rating: 100mW; Mount: Surface Mount; Number of Terminations: 2; Max Operating Temperature: 155°C; Case Code (Metric): 1608; Height: 0.022inch; Case/Package: 0603; Min Operating Temperature: -55°C; REACH SVHC: No SVHC; Series: ERJ; Features: Automotive AEC-Q200; Military Standard: Not; Lead Free: Lead Free; Width: 0.031inch; Case Code (Imperial): 0603; Resistance Tolerance: 1%; Packaging: Tape and Reel; Termination: SMD/SMT; Tolerance: 1%; Contact Plating: Tin; Depth: 0.8mm; Resistor Type: Thick Film; Construction: Rectangular; RoHS Compliant: Yes; Max Power Dissipation: 100mW; Package Quantity: 1; Length: 1.6mm
R50 = CMP-2000-00213-2: Chip Resistor, 120 Ohm, +/- 1%, 0.1 W, -55 to 155 degC, 0603 (1608 Metric), RoHS, Tape and Reel; Manufacturer: Panasonic; Power Rating: 100mW; Voltage Rating (DC): 75V; Resistance: 120Ohm; Temperature Coefficient: 100ppm/degreesC; Number of Terminations: 2; Military Standard: Not; Tolerance: 1%; Min Operating Temperature: -55degC; Packaging: TapeandReel; Lead Free: LeadFree; Max Operating Temperature: 155degC; Manufacturer URL: http://www.panasonic.com/; Case Code (Imperial): 0603; REACH SVHC: NoSVHC; Width: 0.031inch; Datasheet URL: https://industrial.panasonic.com/cdbs/www-data/pdf/RDA0000/AOA0000C283.pdf; RoHSCompliant: true; Max Power Dissipation: 100mW; Termination: SMD/SMT; Package Reference: 0603; Height: 0.022inch; Depth: 0.8mm; Package Description: 2-Pin Surface Mount Device, Body 1.6 x 0.85 mm; Contact Plating: Tin; Length: 1.6mm; Package URL: http://www.st.com/st-web-ui/static/active/en/resource/technical/document/datasheet/CD00001320.pdf; Radiation Hardening: No; Package Quantity: 1; Number of Pins: 2; Datasheet Version: 42095.0; Voltage Rating: 75V; Composition: ThickFilm; Case/Package: 0603; Mount: SurfaceMount; Case Code (Metric): 1608
SW3 = CMP-10040-000029-1: as SW1 on sheet STM32H730_PINOUT; Contact Plating: Gold; Insulation Color: Black; Min Operating Temperature: -40°C; Packaging: Tape and Reel; Flammability Rating: UL94 V-0; Max Operating Temperature: 85°C; Termination: Solder; Mount: Surface Mount
U4 = CMP-318-000000-2: Automotive CAN FD transceiver with watchdog, bus diagnostics and partial networking via sele 14-SOT-23-THIN -40 to 150; Component Type: Standard; Design Item ID: CMP-015-00012-2; Pin Count: 14; Source: TCAN1146DYYRQ1.SchLib

## Nets that join several sheets
3V3: STM32H730_PINOUT (24 pins), PWR_MGMT (C25.1 R38.2 U2.2 U2.4), CAN_IF (C29.2 U4.5)
5V: PWR_MGMT (C27.1 R41.2 U3.2), CAN_IF (C28.2 U4.3)
GND: STEERING_WHEEL_SWITCHES_V2_CONTROLLER (7 pins), STM32H730_PINOUT (35 pins), PWR_MGMT (12 pins), CAN_IF (10 pins)
CAN_INH: PWR_MGMT (R42.2), CAN_IF (U4.7)
CAN_MISO: STM32H730_PINOUT (U1.53), CAN_IF (U4.6)
CAN_MOSI: STM32H730_PINOUT (U1.54), CAN_IF (U4.11)
CAN_N: STEERING_WHEEL_SWITCHES_V2_CONTROLLER (J1.3), CAN_IF (5 pins)
CAN_nCS: STM32H730_PINOUT (U1.51), CAN_IF (U4.14)
CAN_P: STEERING_WHEEL_SWITCHES_V2_CONTROLLER (J1.4), CAN_IF (5 pins)
CAN_PWR: PWR_MGMT (7 pins), CAN_IF (C30.2 R47.1 U4.10)
CAN_RX: STM32H730_PINOUT (U1.59), CAN_IF (U4.4)
CAN_SCLK: STM32H730_PINOUT (U1.52), CAN_IF (U4.8)
CAN_TX: STM32H730_PINOUT (U1.60), CAN_IF (U4.1)
INT_3V3_SENSE: STM32H730_PINOUT (U1.22), PWR_MGMT (R38.1 R39.2)
INT_5V_SENSE: STM32H730_PINOUT (U1.24), PWR_MGMT (R41.1 R44.1)
PWR_IN: STEERING_WHEEL_SWITCHES_V2_CONTROLLER (J1.1), PWR_MGMT (F1.1)
SW_IN_0: STEERING_WHEEL_SWITCHES_V2_CONTROLLER (J2.2), STM32H730_PINOUT (U1.88)
SW_IN_1: STEERING_WHEEL_SWITCHES_V2_CONTROLLER (J2.4), STM32H730_PINOUT (U1.87)
SW_IN_2: STEERING_WHEEL_SWITCHES_V2_CONTROLLER (J2.6), STM32H730_PINOUT (U1.86)
SW_IN_3: STEERING_WHEEL_SWITCHES_V2_CONTROLLER (J2.8), STM32H730_PINOUT (U1.85)
SW_IN_4: STEERING_WHEEL_SWITCHES_V2_CONTROLLER (J2.10), STM32H730_PINOUT (U1.84)
SW_IN_5: STEERING_WHEEL_SWITCHES_V2_CONTROLLER (J2.12), STM32H730_PINOUT (U1.81)
SW_IN_6: STEERING_WHEEL_SWITCHES_V2_CONTROLLER (J2.14), STM32H730_PINOUT (U1.83)
SW_IN_7: STEERING_WHEEL_SWITCHES_V2_CONTROLLER (J2.16), STM32H730_PINOUT (U1.82)
SW_IN_8: STEERING_WHEEL_SWITCHES_V2_CONTROLLER (J3.2), STM32H730_PINOUT (U1.29)
SW_IN_9: STEERING_WHEEL_SWITCHES_V2_CONTROLLER (J3.4), STM32H730_PINOUT (U1.30)
SW_IN_10: STEERING_WHEEL_SWITCHES_V2_CONTROLLER (J3.6), STM32H730_PINOUT (U1.31)
SW_IN_11: STEERING_WHEEL_SWITCHES_V2_CONTROLLER (J3.8), STM32H730_PINOUT (U1.32)
SW_IN_12: STEERING_WHEEL_SWITCHES_V2_CONTROLLER (J3.10), STM32H730_PINOUT (U1.33)
SW_IN_13: STEERING_WHEEL_SWITCHES_V2_CONTROLLER (J3.12), STM32H730_PINOUT (U1.34)
SW_IN_14: STEERING_WHEEL_SWITCHES_V2_CONTROLLER (J3.14), STM32H730_PINOUT (U1.37)
SW_IN_15: STEERING_WHEEL_SWITCHES_V2_CONTROLLER (J3.16), STM32H730_PINOUT (U1.40)
VCC_SENSE: STM32H730_PINOUT (U1.23), PWR_MGMT (R45.1 R46.2)